# EAGLE schematic Wombat Lab Schematic (EAGLE 9.1.3)
COMPANY: ADAFRUIT INDUSTRIES; DRAWN: FZHAO; REV: A

## Sheet 1 of 17
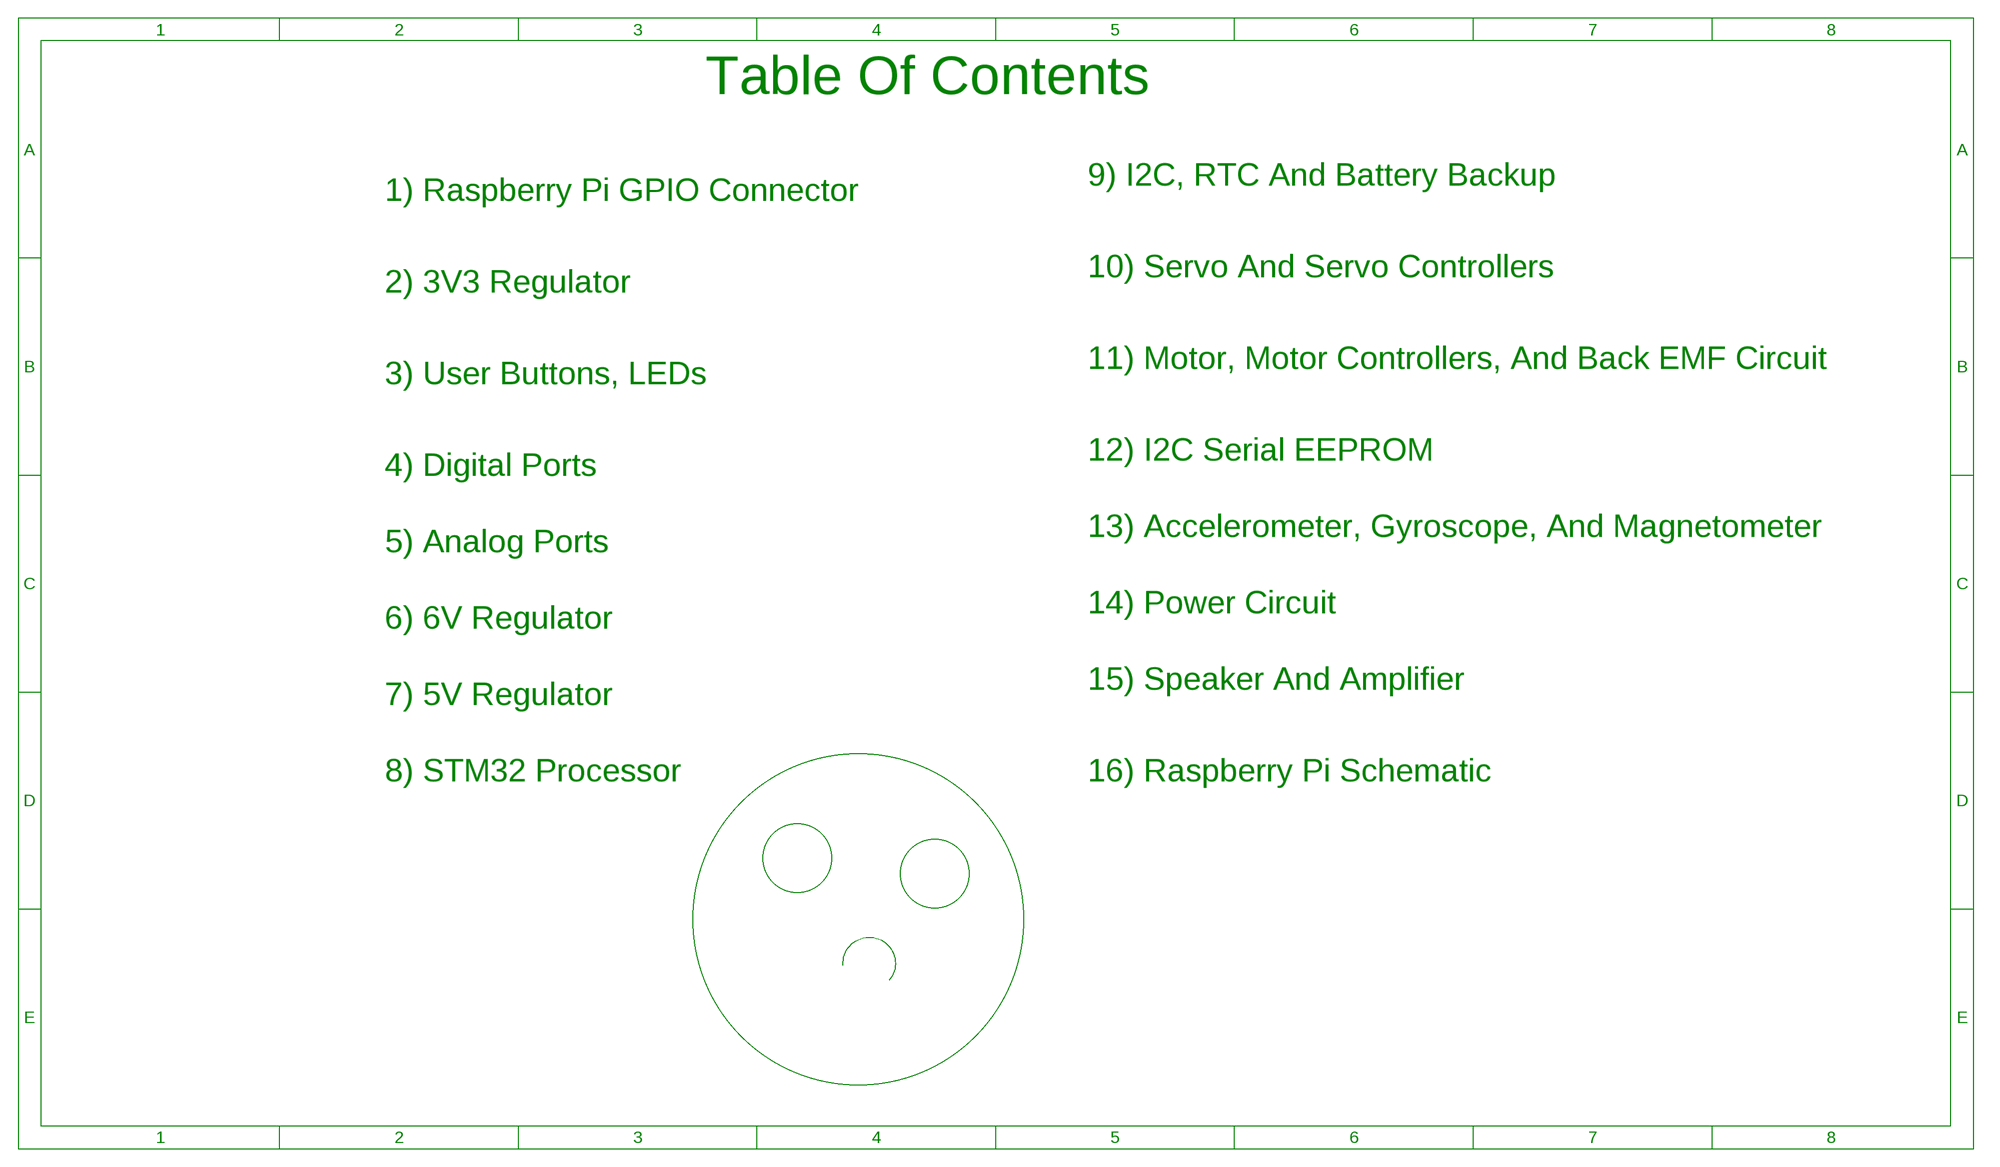
[diagram p0: schematic, sheet 1]

### Notes on the sheet
- Table Of Contents
- 9) I2C, RTC And Battery Backup
- 1) Raspberry Pi GPIO Connector
- 10) Servo And Servo Controllers
- 2) 3V3 Regulator
- 11) Motor, Motor Controllers, And Back EMF Circuit
- 3) User Buttons, LEDs
- 12) I2C Serial EEPROM
- 4) Digital Ports
- 13) Accelerometer, Gyroscope, And Magnetometer
- 5) Analog Ports
- 14) Power Circuit
- 6) 6V Regulator
- 15) Speaker And Amplifier
- 7) 5V Regulator
- 8) STM32 Processor | 16) Raspberry Pi Schematic

## Sheet 2 of 17
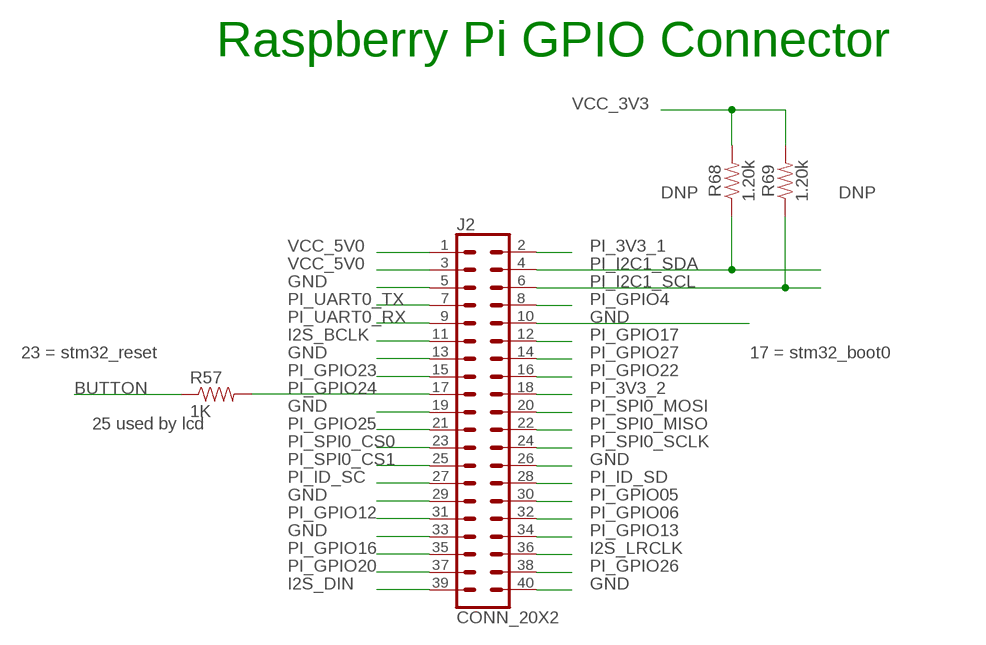
[diagram p1: schematic, sheet 2]

### Parts
J2  CONN_20X2  [2X20]
R57  1K  RESISTOR0603-RES  [0603-RES]
R68  1.20k  1.20KOHM-0603-1/10W-1%  [0603]
R69  1.20k  1.20KOHM-0603-1/10W-1%  [0603]

### Nets
BUTTON: R57.1 ; also sheet 4,9
GND: J2.5 J2.10 J2.13 J2.19 J2.26 J2.29 J2.33 J2.40 ; also sheet 3,4,5,6,7,8,9,10,11,12,13,14,15,16,17
I2S_BCLK: J2.11 ; also sheet 16
I2S_DIN: J2.39 ; also sheet 16
I2S_LRCLK: J2.36 ; also sheet 16
PI_3V3_1: J2.2
PI_3V3_2: J2.18
PI_GPIO4: J2.8
PI_GPIO05: J2.30
PI_GPIO06: J2.32
PI_GPIO12: J2.31
PI_GPIO13: J2.34
PI_GPIO16: J2.35
PI_GPIO17: J2.12 ; also sheet 9
PI_GPIO20: J2.37
PI_GPIO22: J2.16
PI_GPIO23: J2.15 ; also sheet 9
PI_GPIO24: J2.17 R57.2
PI_GPIO25: J2.21 ; also sheet 17
PI_GPIO26: J2.38
PI_GPIO27: J2.14
PI_I2C1_SCL: J2.6 R69.1 ; also sheet 10,13,17
PI_I2C1_SDA: J2.4 R68.1 ; also sheet 10,13,17
PI_ID_SC: J2.27
PI_ID_SD: J2.28
PI_SPI0_CS0: J2.23 ; also sheet 9
PI_SPI0_CS1: J2.25
PI_SPI0_MISO: J2.22 ; also sheet 9
PI_SPI0_MOSI: J2.20 ; also sheet 9
PI_SPI0_SCLK: J2.24 ; also sheet 9
PI_UART0_RX: J2.9 ; also sheet 9
PI_UART0_TX: J2.7 ; also sheet 9
VCC_3V3: R68.2 R69.2 ; also sheet 3,4,5,6,9,10,11,12,13,14,15,17
VCC_5V0: J2.1 J2.3 ; also sheet 3,8,11,16,17

### Notes on the sheet
- Raspberry Pi GPIO Connector
- DNP | DNP
- 23 = stm32_reset | 17 = stm32_boot0
- 25 used by lcd

## Sheet 3 of 17
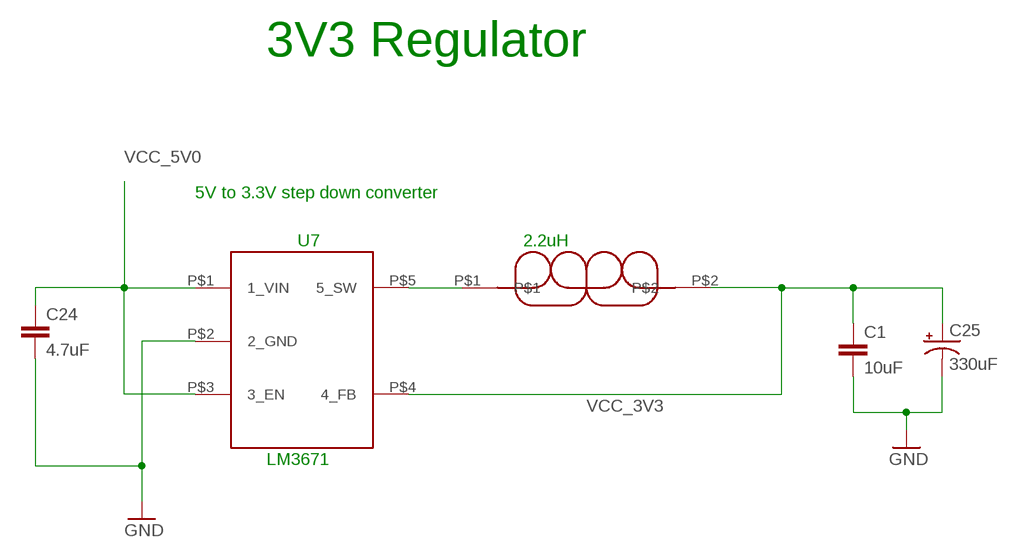
[diagram p2: schematic, sheet 3]

### Parts
C1  10uF  CAP0603-CAP  [0603-CAP]
C24  4.7uF  CAP0603-CAP  [0603-CAP]
C25  330uF  CAP_POLD  [PANASONIC_D]
U7  LM3671  [SOT-23-5]
U8  2.2uH  CDRH2D14NP  [3P2MM-X-3P2MM-INDUCTOR]

### Nets
GND: C1.2 C24.2 C25.- U7.P$2(2_GND) ; also sheet 2,4,5,6,7,8,9,10,11,12,13,14,15,16,17
N$10: U7.P$5(5_SW) U8.P$1
VCC_3V3: C1.1 C25.+ U7.P$4(4_FB) U8.P$2 ; also sheet 2,4,5,6,9,10,11,12,13,14,15,17
VCC_5V0: C24.1 U7.P$1(1_VIN) U7.P$3(3_EN) ; also sheet 2,8,11,16,17

### Notes on the sheet
- 3V3 Regulator
- 5V to 3.3V step down converter
- U7 | 2.2uH
- LM3671

## Sheet 4 of 17
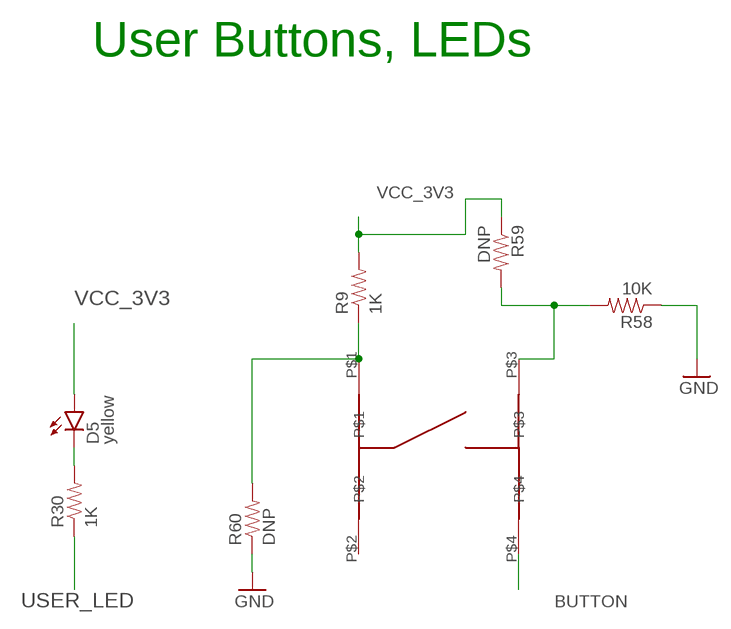
[diagram p3: schematic, sheet 4]

### Parts
D5  yellow  LED0603  [LED-0603]
R9  1K  RESISTOR0603-RES  [0603-RES]
R30  1K  RESISTOR0603-RES  [0603-RES]
R58  10K  RESISTOR0603-RES  [0603-RES]
R59  DNP  RESISTOR0603-RES  [0603-RES]
R60  DNP  RESISTOR0603-RES  [0603-RES]
U75  PUSHBUTTON-1571527-2  [BUTTON-1571527-2]

### Nets
BUTTON: U75.P$4 ; also sheet 2,9
GND: R58.1 R60.1 ; also sheet 2,3,5,6,7,8,9,10,11,12,13,14,15,16,17
N$19: D5.C R30.2
N$64: R9.1 R60.2 U75.P$1
N$65: R58.2 R59.2 U75.P$3
USER_LED: R30.1 ; also sheet 9
VCC_3V3: D5.A R9.2 R59.1 ; also sheet 2,3,5,6,9,10,11,12,13,14,15,17
Unconnected: U75.P$2

### Notes on the sheet
- User Buttons, LEDs

## Sheet 5 of 17
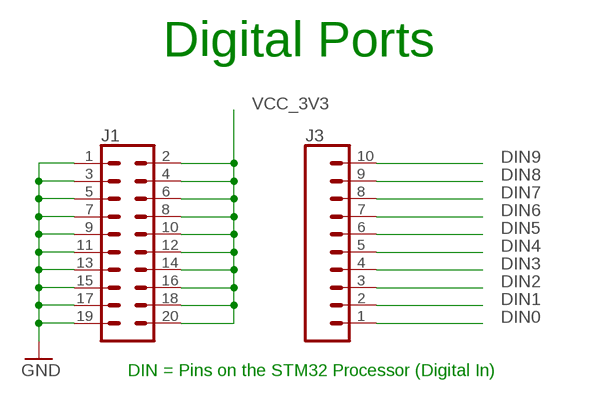
[diagram p4: schematic, sheet 5]

### Parts
J1  CONN_10X2  [2X10]
J3  CONN_10"  [1X10]

### Nets
DIN0: J3.1 ; also sheet 9
DIN1: J3.2 ; also sheet 9
DIN2: J3.3 ; also sheet 9
DIN3: J3.4 ; also sheet 9
DIN4: J3.5 ; also sheet 9
DIN5: J3.6 ; also sheet 9
DIN6: J3.7 ; also sheet 9
DIN7: J3.8 ; also sheet 9
DIN8: J3.9 ; also sheet 9
DIN9: J3.10 ; also sheet 9
GND: J1.1 J1.3 J1.5 J1.7 J1.9 J1.11 J1.13 J1.15 J1.17 J1.19 ; also sheet 2,3,4,6,7,8,9,10,11,12,13,14,15,16,17
VCC_3V3: J1.2 J1.4 J1.6 J1.8 J1.10 J1.12 J1.14 J1.16 J1.18 J1.20 ; also sheet 2,3,4,6,9,10,11,12,13,14,15,17

### Notes on the sheet
- Digital Ports
- DIN = Pins on the STM32 Processor (Digital In)

## Sheet 6 of 17
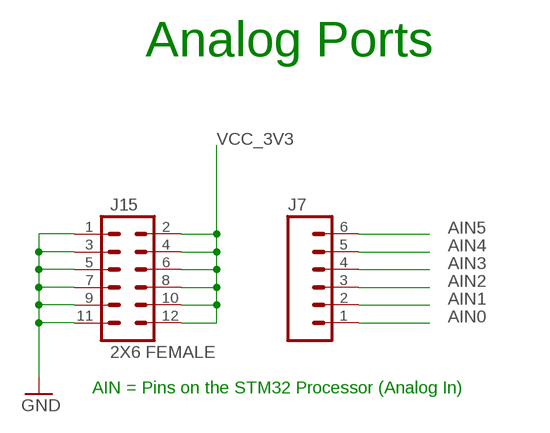
[diagram p5: schematic, sheet 6]

### Parts
J7  M06SILK_FEMALE_PTH  [1X06]
J15  2X6 FEMALE  M06X2PTH_FEMALE  [2X6]

### Nets
AIN0: J7.1 ; also sheet 9
AIN1: J7.2 ; also sheet 9
AIN2: J7.3 ; also sheet 9
AIN3: J7.4 ; also sheet 9
AIN4: J7.5 ; also sheet 9
AIN5: J7.6 ; also sheet 9
GND: J15.1 J15.3 J15.5 J15.7 J15.9 J15.11 ; also sheet 2,3,4,5,7,8,9,10,11,12,13,14,15,16,17
VCC_3V3: J15.2 J15.4 J15.6 J15.8 J15.10 J15.12 ; also sheet 2,3,4,5,9,10,11,12,13,14,15,17

### Notes on the sheet
- Analog Ports
- AIN = Pins on the STM32 Processor (Analog In)

## Sheet 7 of 17
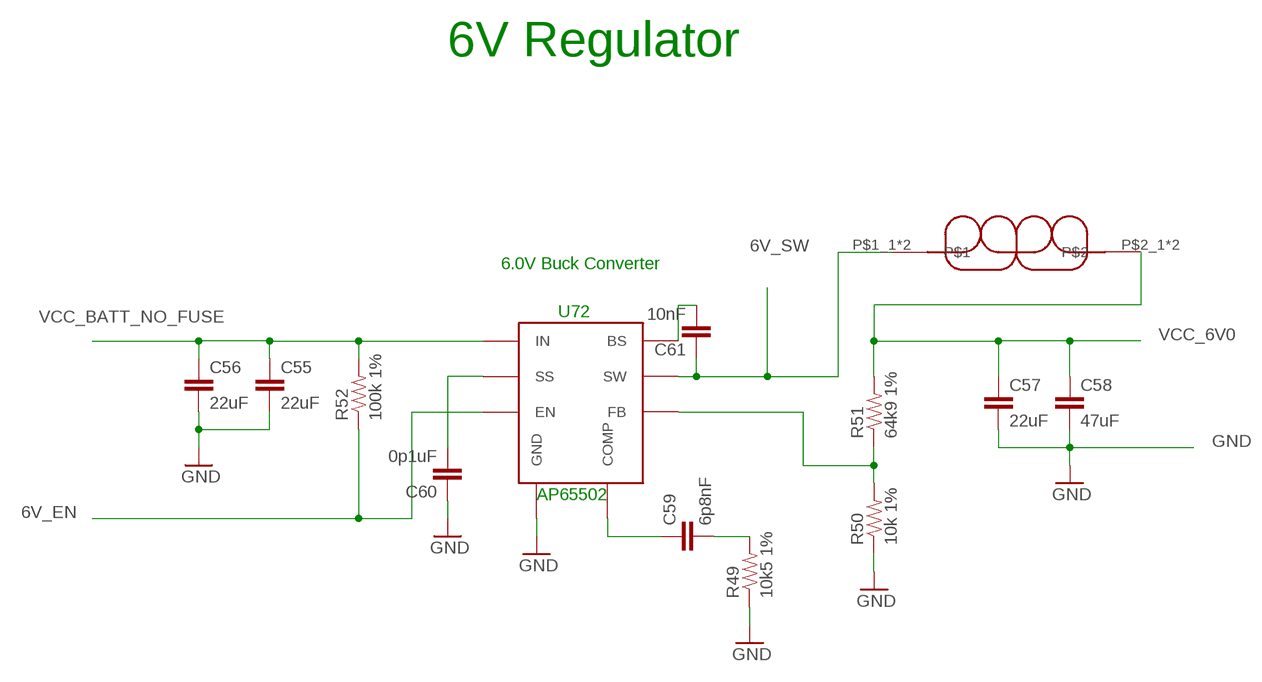
[diagram p6: schematic, sheet 7]

### Parts
C55  22uF  CAP1210  [1210@1]
C56  22uF  CAP1210  [1210@1]
C57  22uF  CAP1210  [1210@1]
C58  47uF  CAP1210  [1210@1]
C59  6p8nF  CAP0603-CAP  [0603-CAP]
C60  0p1uF  CAP0603-CAP  [0603-CAP]
C61  10nF  CAP0603-CAP  [0603-CAP]
L2  6.5uH  INDUCTOR-COMBO-3232-1050  [INDUCT-3232-1050]
R49  10k5 1%  RESISTOR0603  [0603-RES]
R50  10k 1%  RESISTOR0603  [0603-RES]
R51  64k9 1%  RESISTOR0603  [0603-RES]
R52  100k 1%  RESISTOR0603  [0603-RES]
U72  AP65502  AP65502SP-13  [SO-8EP]

### Nets
6V_EN: R52.1 U72.7(EN) ; also sheet 9
6V_SW: C61.1 L2.P$1_1 L2.P$1_2 U72.3(SW)
GND: C55.2 C56.2 C57.2 C58.2 C60.1 R49.1 R50.1 U72.4(GND) U72.GND U72.V$1(GND) U72.V$2(GND) U72.V$3(GND) U72.V$4(GND) U72.V$5(GND) U72.V$6(GND) U72.V$7(GND) U72.V$8(GND) U72.V$9(GND) U72.V$10(GND) U72.V$11(GND) U72.V$12(GND) U72.V$13(GND) U72.V$14(GND) U72.V$15(GND) ; also sheet 2,3,4,5,6,8,9,10,11,12,13,14,15,16,17
N$32: C61.2 U72.1(BS)
N$33: C59.1 U72.6(COMP)
N$34: C59.2 R49.2
N$35: C60.2 U72.8(SS)
N$36: R50.2 R51.1 U72.5(FB)
VCC_6V0: C57.1 C58.1 L2.P$2_1 L2.P$2_2 R51.2 ; also sheet 11
VCC_BATT_NO_FUSE: C55.1 C56.1 R52.2 U72.2(IN) ; also sheet 8,15

### Notes on the sheet
- 6V Regulator
- 6.0V Buck Converter
- U72
- AP65502

## Sheet 8 of 17
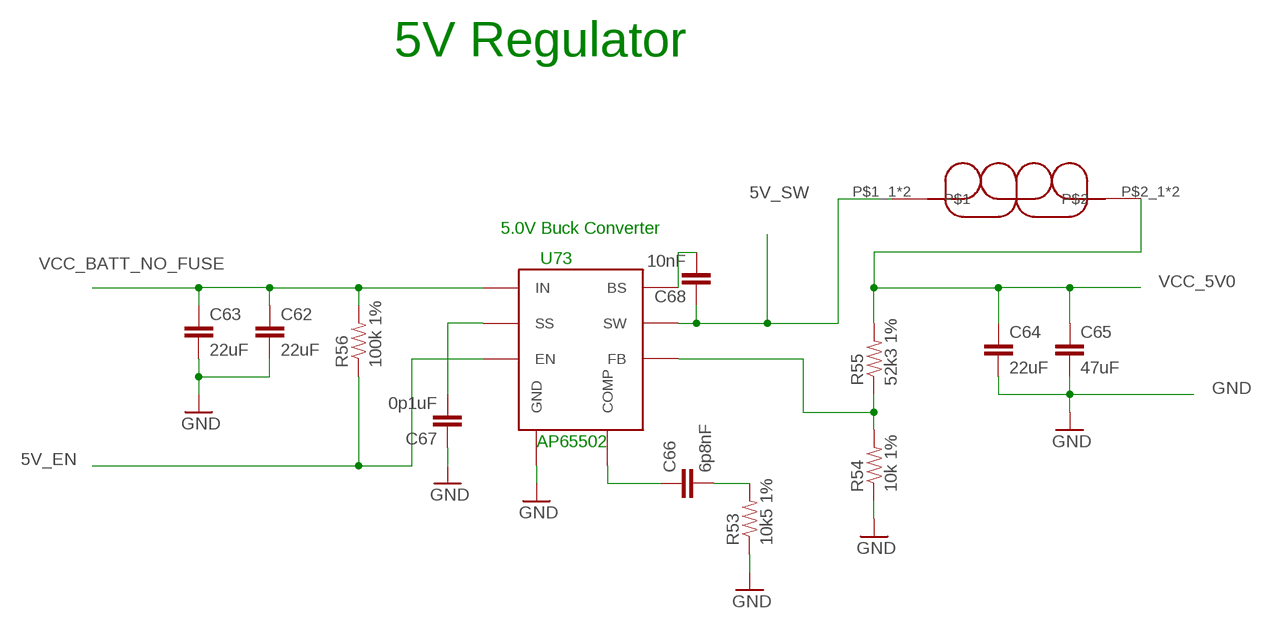
[diagram p7: schematic, sheet 8]

### Parts
C62  22uF  CAP1210  [1210@1]
C63  22uF  CAP1210  [1210@1]
C64  22uF  CAP1210  [1210@1]
C65  47uF  CAP1210  [1210@1]
C66  6p8nF  CAP0603-CAP  [0603-CAP]
C67  0p1uF  CAP0603-CAP  [0603-CAP]
C68  10nF  CAP0603-CAP  [0603-CAP]
L4  6.5uH  INDUCTOR-COMBO-3232-1050  [INDUCT-3232-1050]
R53  10k5 1%  RESISTOR0603  [0603-RES]
R54  10k 1%  RESISTOR0603  [0603-RES]
R55  52k3 1%  RESISTOR0603  [0603-RES]
R56  100k 1%  RESISTOR0603  [0603-RES]
U73  AP65502  AP65502SP-13  [SO-8EP]

### Nets
5V_EN: R56.1 U73.7(EN)
5V_SW: C68.1 L4.P$1_1 L4.P$1_2 U73.3(SW)
GND: C62.2 C63.2 C64.2 C65.2 C67.1 R53.1 R54.1 U73.4(GND) U73.GND U73.V$1(GND) U73.V$2(GND) U73.V$3(GND) U73.V$4(GND) U73.V$5(GND) U73.V$6(GND) U73.V$7(GND) U73.V$8(GND) U73.V$9(GND) U73.V$10(GND) U73.V$11(GND) U73.V$12(GND) U73.V$13(GND) U73.V$14(GND) U73.V$15(GND) ; also sheet 2,3,4,5,6,7,9,10,11,12,13,14,15,16,17
N$37: C68.2 U73.1(BS)
N$38: C66.1 U73.6(COMP)
N$39: C66.2 R53.2
N$41: C67.2 U73.8(SS)
N$42: R54.2 R55.1 U73.5(FB)
VCC_5V0: C64.1 C65.1 L4.P$2_1 L4.P$2_2 R55.2 ; also sheet 2,3,11,16,17
VCC_BATT_NO_FUSE: C62.1 C63.1 R56.2 U73.2(IN) ; also sheet 7,15

### Notes on the sheet
- 5V Regulator
- 5.0V Buck Converter
- U73
- AP65502

## Sheet 9 of 17
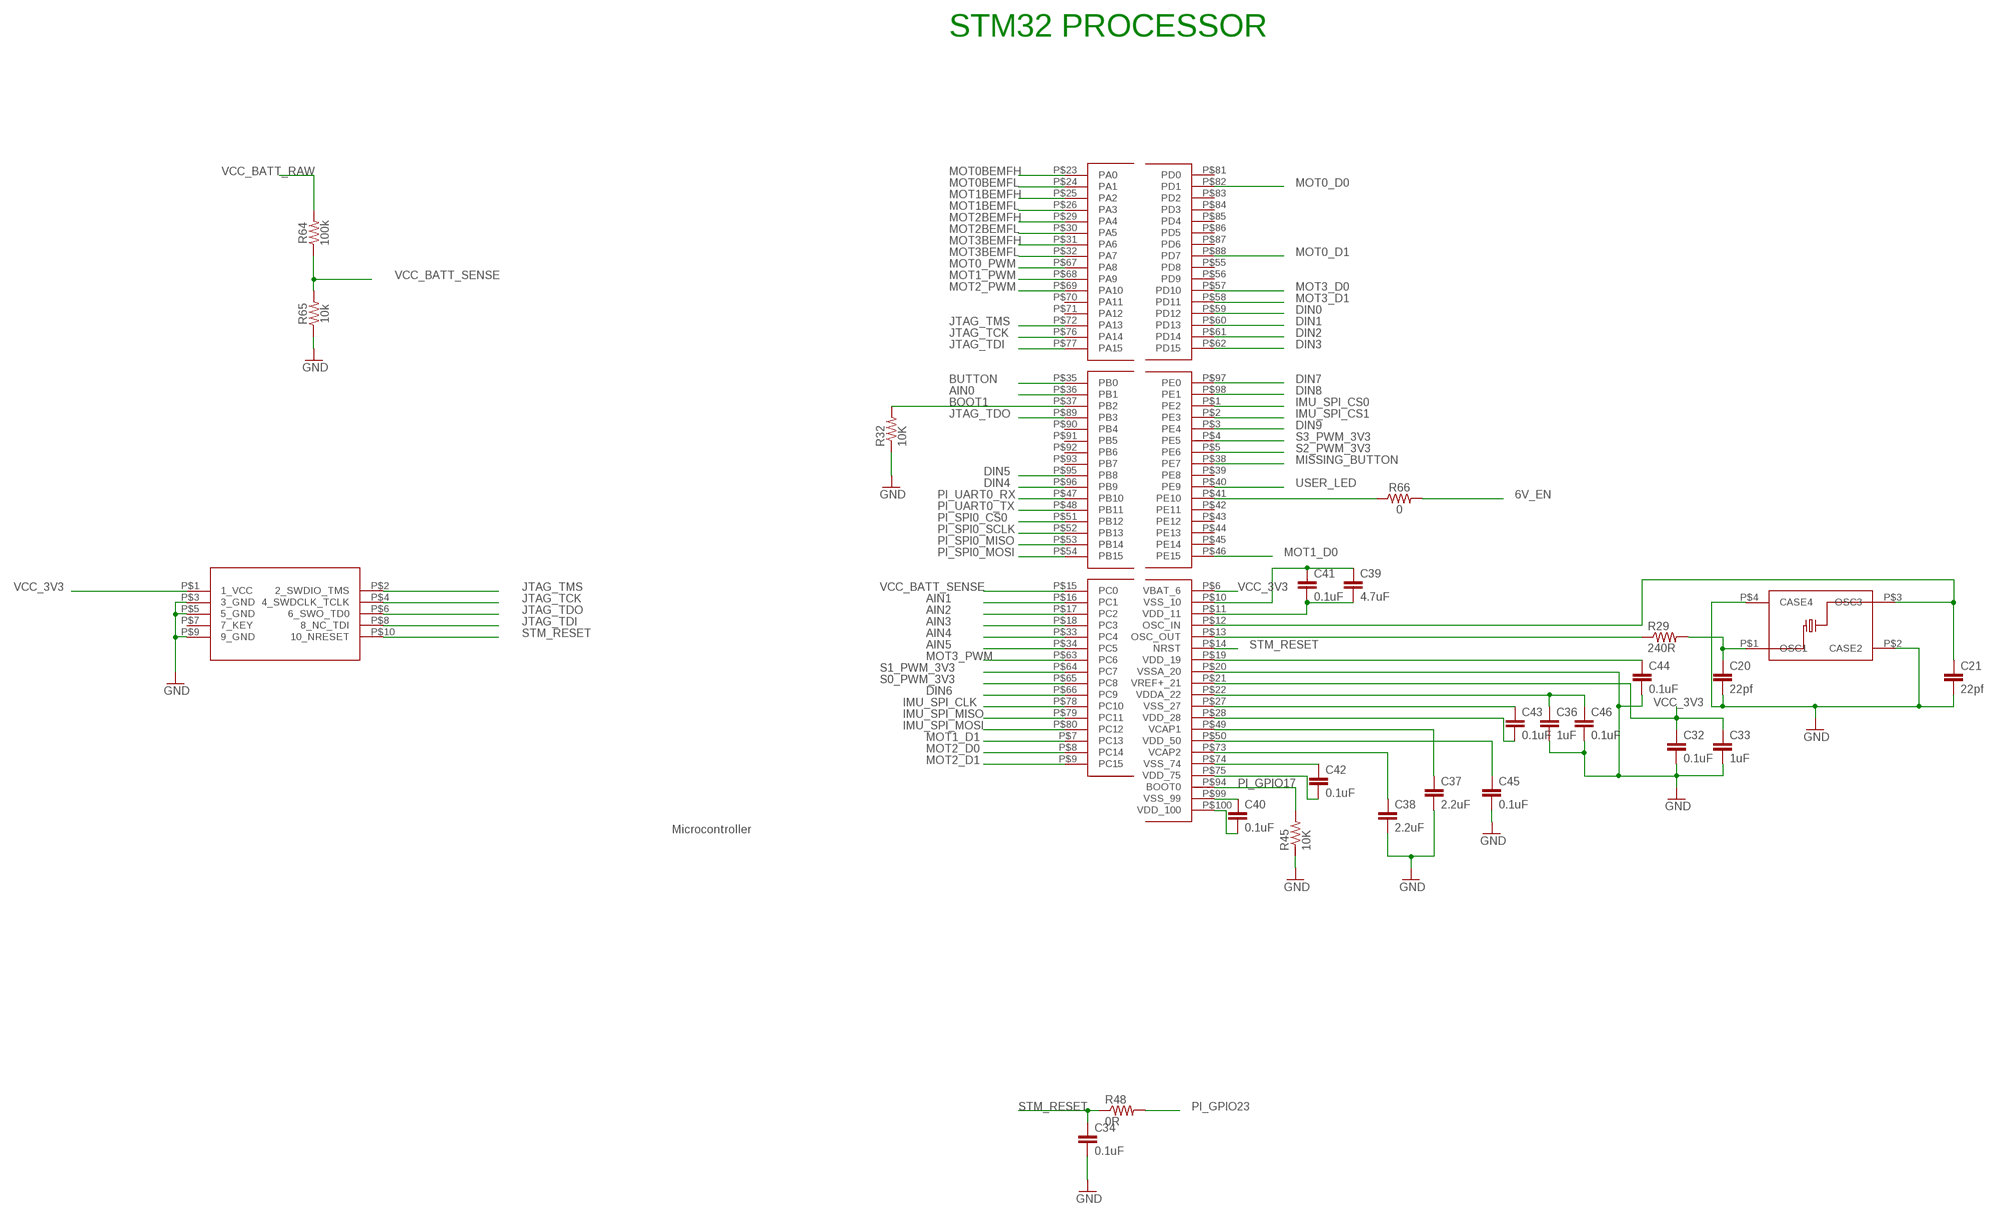
[diagram p8: schematic, sheet 9]

### Parts
C20  22pf  CAP0603-CAP  [0603-CAP]
C21  22pf  CAP0603-CAP  [0603-CAP]
C32  0.1uF  CAP0603-CAP  [0603-CAP]
C33  1uF  CAP0603-CAP  [0603-CAP]
C34  0.1uF  CAP0603-CAP  [0603-CAP]
C36  1uF  CAP0603-CAP  [0603-CAP]
C37  2.2uF  CAP0603-CAP  [0603-CAP]
C38  2.2uF  CAP0603-CAP  [0603-CAP]
C39  4.7uF  CAP0603-CAP  [0603-CAP]
C40  0.1uF  CAP0603-CAP  [0603-CAP]
C41  0.1uF  CAP0603-CAP  [0603-CAP]
C42  0.1uF  CAP0603-CAP  [0603-CAP]
C43  0.1uF  CAP0603-CAP  [0603-CAP]
C44  0.1uF  CAP0603-CAP  [0603-CAP]
C45  0.1uF  CAP0603-CAP  [0603-CAP]
C46  0.1uF  CAP0603-CAP  [0603-CAP]
R29  240R  RESISTOR0603  [0603-RES]
R32  10K  RESISTOR0603  [0603-RES]
R45  10K  RESISTOR0603  [0603-RES]
R48  0R  RESISTOR0603  [0603-RES]
R64  100k  100KOHM-0603-1/10W-1%  [0603]
R65  10k  10KOHM-0603-1/10W-1%  [0603]
R66  0  0OHM-0603-1/10W-5%  [0603]
U37  STM32F427VIT6  [LQFP-100]
U38  TSX-3325  [TSX-3225]
U39  CORTEX_JTAG  [CORTEX-JTAG-HDR]

### Nets
6V_EN: R66.2 ; also sheet 7
AIN0: U37.P$36(PB1) ; also sheet 6
AIN1: U37.P$16(PC1) ; also sheet 6
AIN2: U37.P$17(PC2) ; also sheet 6
AIN3: U37.P$18(PC3) ; also sheet 6
AIN4: U37.P$33(PC4) ; also sheet 6
AIN5: U37.P$34(PC5) ; also sheet 6
BOOT1: R32.2 U37.P$37(PB2)
BUTTON: U37.P$35(PB0) ; also sheet 2,4
DIN0: U37.P$59(PD12) ; also sheet 5
DIN1: U37.P$60(PD13) ; also sheet 5
DIN2: U37.P$61(PD14) ; also sheet 5
DIN3: U37.P$62(PD15) ; also sheet 5
DIN4: U37.P$96(PB9) ; also sheet 5
DIN5: U37.P$95(PB8) ; also sheet 5
DIN6: U37.P$66(PC9) ; also sheet 5
DIN7: U37.P$97(PE0) ; also sheet 5
DIN8: U37.P$98(PE1) ; also sheet 5
DIN9: U37.P$3(PE4) ; also sheet 5
GND: C20.2 C21.2 C32.2 C33.2 C34.2 C36.2 C37.2 C38.2 C39.1 C40.1 C41.1 C42.1 C43.1 C44.2 C45.2 C46.2 R32.1 R45.1 R65.1 U37.P$10(VSS_10) U37.P$20(VSSA_20) U37.P$27(VSS_27) U37.P$74(VSS_74) U37.P$99(VSS_99) U38.P$2(CASE2) U38.P$4(CASE4) U39.P$3(3_GND) U39.P$5(5_GND) U39.P$9(9_GND) ; also sheet 2,3,4,5,6,7,8,10,11,12,13,14,15,16,17
IMU_SPI_CLK: U37.P$78(PC10) ; also sheet 14
IMU_SPI_CS0: U37.P$1(PE2) ; also sheet 14
IMU_SPI_CS1: U37.P$2(PE3)
IMU_SPI_MISO: U37.P$79(PC11) ; also sheet 14
IMU_SPI_MOSI: U37.P$80(PC12) ; also sheet 14
JTAG_TCK: U37.P$76(PA14) U39.P$4(4_SWDCLK_TCLK)
JTAG_TDI: U37.P$77(PA15) U39.P$8(8_NC_TDI)
JTAG_TDO: U37.P$89(PB3) U39.P$6(6_SWO_TD0)
JTAG_TMS: U37.P$72(PA13) U39.P$2(2_SWDIO_TMS)
MISSING_BUTTON: U37.P$38(PE7)
MOT0_D0: U37.P$82(PD1) ; also sheet 12
MOT0_D1: U37.P$88(PD7) ; also sheet 12
MOT0_PWM: U37.P$67(PA8) ; also sheet 12
MOT0BEMFH: U37.P$23(PA0) ; also sheet 12
MOT0BEMFL: U37.P$24(PA1) ; also sheet 12
MOT1_D0: U37.P$46(PE15) ; also sheet 12
MOT1_D1: U37.P$7(PC13) ; also sheet 12
MOT1_PWM: U37.P$68(PA9) ; also sheet 12
MOT1BEMFH: U37.P$25(PA2) ; also sheet 12
MOT1BEMFL: U37.P$26(PA3) ; also sheet 12
MOT2_D0: U37.P$8(PC14) ; also sheet 12
MOT2_D1: U37.P$9(PC15) ; also sheet 12
MOT2_PWM: U37.P$69(PA10) ; also sheet 12
MOT2BEMFH: U37.P$29(PA4) ; also sheet 12
MOT2BEMFL: U37.P$30(PA5) ; also sheet 12
MOT3_D0: U37.P$57(PD10) ; also sheet 12
MOT3_D1: U37.P$58(PD11) ; also sheet 12
MOT3_PWM: U37.P$63(PC6) ; also sheet 12
MOT3BEMFH: U37.P$31(PA6) ; also sheet 12
MOT3BEMFL: U37.P$32(PA7) ; also sheet 12
N$40: C20.1 R29.2 U38.P$1(OSC1)
N$69: R66.1 U37.P$41(PE10)
OSC_IN: C21.1 U37.P$12(OSC_IN) U38.P$3(OSC3)
OSC_OUT: R29.1 U37.P$13(OSC_OUT)
PI_GPIO17: R45.2 U37.P$94(BOOT0) ; also sheet 2
PI_GPIO23: R48.2 ; also sheet 2
PI_SPI0_CS0: U37.P$51(PB12) ; also sheet 2
PI_SPI0_MISO: U37.P$53(PB14) ; also sheet 2
PI_SPI0_MOSI: U37.P$54(PB15) ; also sheet 2
PI_SPI0_SCLK: U37.P$52(PB13) ; also sheet 2
PI_UART0_RX: U37.P$47(PB10) ; also sheet 2
PI_UART0_TX: U37.P$48(PB11) ; also sheet 2
S0_PWM_3V3: U37.P$65(PC8) ; also sheet 11
S1_PWM_3V3: U37.P$64(PC7) ; also sheet 11
S2_PWM_3V3: U37.P$5(PE6) ; also sheet 11
S3_PWM_3V3: U37.P$4(PE5) ; also sheet 11
STM_RESET: C34.1 R48.1 U37.P$14(NRST) U39.P$10(10_NRESET)
USER_LED: U37.P$40(PE9) ; also sheet 4
VCAP1: C37.1 U37.P$49(VCAP1)
VCAP2: C38.1 U37.P$73(VCAP2)
VCC_3V3: C32.1 C33.1 C36.1 C39.2 C40.2 C41.2 C42.2 C43.2 C44.1 C45.1 C46.1 U37.P$6(VBAT_6) U37.P$11(VDD_11) U37.P$19(VDD_19) U37.P$21(VREF+_21) U37.P$22(VDDA_22) U37.P$28(VDD_28) U37.P$50(VDD_50) U37.P$75(VDD_75) U37.P$100(VDD_100) U39.P$1(1_VCC) ; also sheet 2,3,4,5,6,10,11,12,13,14,15,17
VCC_BATT_RAW: R64.2 ; also sheet 15
VCC_BATT_SENSE: R64.1 R65.2 U37.P$15(PC0)
Unconnected: U37.P$39(PE8) U37.P$42(PE11) U37.P$43(PE12) U37.P$44(PE13) U37.P$45(PE14) U37.P$55(PD8) U37.P$56(PD9) U37.P$70(PA11) U37.P$71(PA12) U37.P$81(PD0) U37.P$83(PD2) U37.P$84(PD3) U37.P$85(PD4) U37.P$86(PD5) U37.P$87(PD6) U37.P$90(PB4) U37.P$91(PB5) U37.P$92(PB6) U37.P$93(PB7) U39.P$7(7_KEY)

### Notes on the sheet
- STM32 PROCESSOR
- Microcontroller

## Sheet 10 of 17
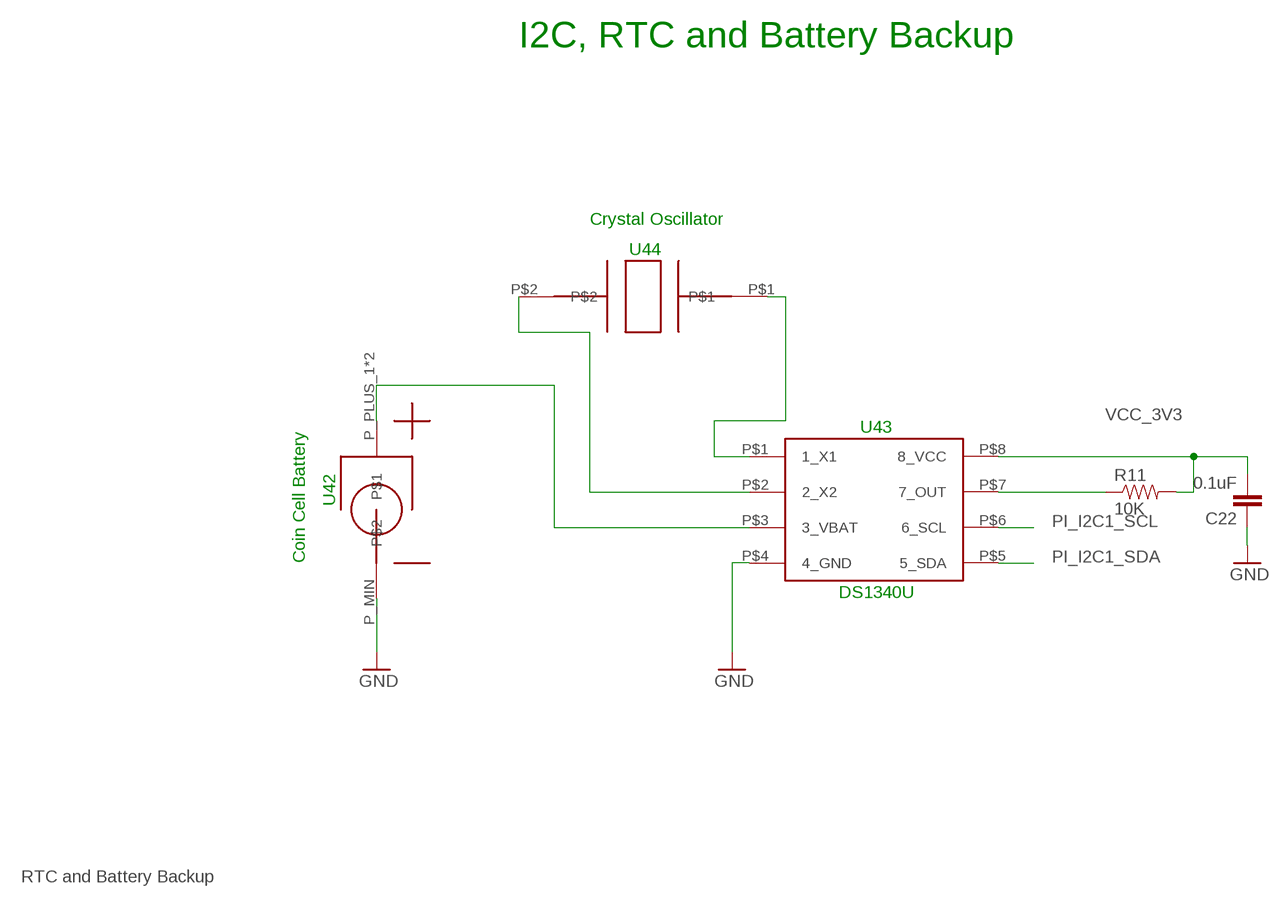
[diagram p9: schematic, sheet 10]

### Parts
C22  0.1uF  CAP0603-CAP  [0603-CAP]
R11  10K  RESISTOR0603  [0603-RES]
U42  COINCELL_6P8MM  [COIN_CELL_HOLDER_6P8MM]
U43  DS1340U  [USOP-8]
U44  CRYSTAL-ECS-ECX34B  [CRYSTAL-ECX34B-3P2MM_1P5MM]

### Nets
GND: C22.1 U42.P_MIN U43.P$4(4_GND) ; also sheet 2,3,4,5,6,7,8,9,11,12,13,14,15,16,17
N$15: U42.P_PLUS_1 U42.P_PLUS_2 U43.P$3(3_VBAT)
N$16: U43.P$2(2_X2) U44.P$2
N$17: U43.P$1(1_X1) U44.P$1
N$21: R11.1 U43.P$7(7_OUT)
PI_I2C1_SCL: U43.P$6(6_SCL) ; also sheet 2,13,17
PI_I2C1_SDA: U43.P$5(5_SDA) ; also sheet 2,13,17
VCC_3V3: C22.2 R11.2 U43.P$8(8_VCC) ; also sheet 2,3,4,5,6,9,11,12,13,14,15,17

### Notes on the sheet
- I2C, RTC and Battery Backup
- Crystal Oscillator
- U44
- U43
- U42
- Coin Cell Battery
- DS1340U
- RTC and Battery Backup

## Sheet 11 of 17
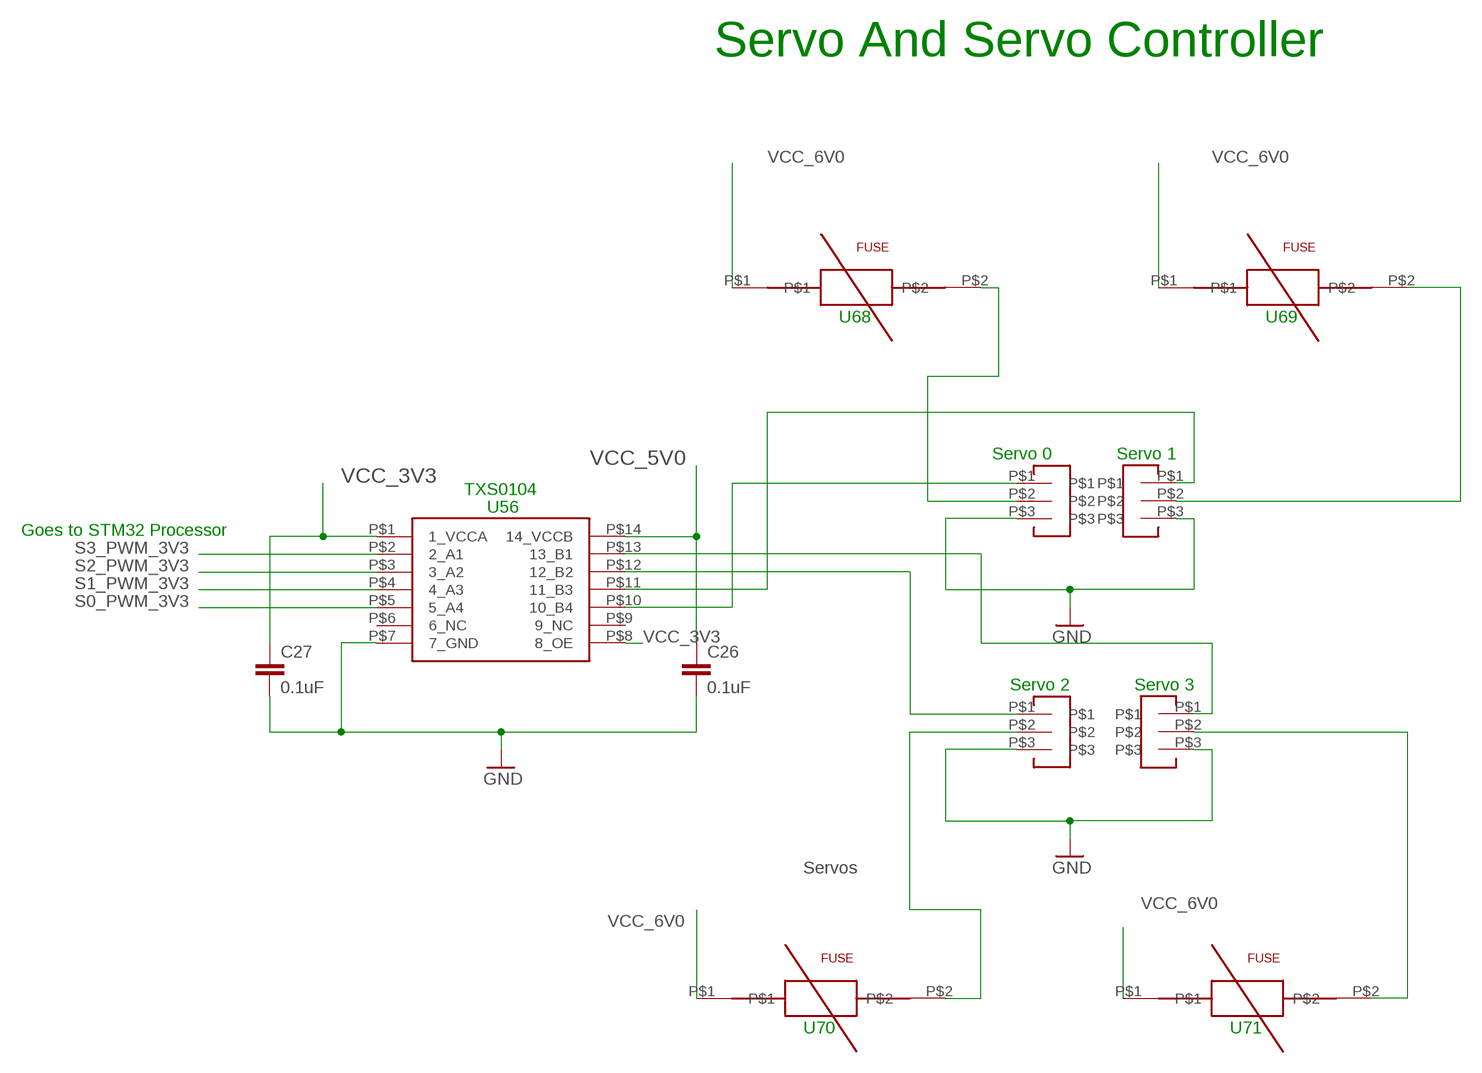
[diagram p10: schematic, sheet 11]

### Parts
C26  0.1uF  CAP0603-CAP  [0603-CAP]
C27  0.1uF  CAP0603-CAP  [0603-CAP]
U30  CONN-HEADER-5-103414-1  [HEADER-5-103414-1]
U41  CONN-HEADER-5-103414-1  [HEADER-5-103414-1]
U56  TXS0104  [TSSOP14]
U68  FUSE-RESET-0603L100SLYR  [0603]
U69  FUSE-RESET-0603L100SLYR  [0603]
U70  FUSE-RESET-0603L100SLYR  [0603]
U71  FUSE-RESET-0603L100SLYR  [0603]
U76  CONN-HEADER-5-103414-1  [HEADER-5-103414-1]
U77  CONN-HEADER-5-103414-1  [HEADER-5-103414-1]

### Nets
GND: C26.2 C27.2 U30.P$3 U41.P$3 U56.P$7(7_GND) U76.P$3 U77.P$3 ; also sheet 2,3,4,5,6,7,8,9,10,12,13,14,15,16,17
N$28: U71.P$2 U77.P$2
N$29: U70.P$2 U76.P$2
N$30: U30.P$2 U68.P$2
N$31: U41.P$2 U69.P$2
S0_PWM_3V3: U56.P$5(5_A4) ; also sheet 9
S0_PWM_5V0: U30.P$1 U56.P$10(10_B4)
S1_PWM_3V3: U56.P$4(4_A3) ; also sheet 9
S1_PWM_5V0: U41.P$1 U56.P$11(11_B3)
S2_PWM_3V3: U56.P$3(3_A2) ; also sheet 9
S2_PWM_5V0: U56.P$12(12_B2) U76.P$1
S3_PWM_3V3: U56.P$2(2_A1) ; also sheet 9
S3_PWM_5V0: U56.P$13(13_B1) U77.P$1
VCC_3V3: C27.1 U56.P$1(1_VCCA) U56.P$8(8_OE) ; also sheet 2,3,4,5,6,9,10,12,13,14,15,17
VCC_5V0: C26.1 U56.P$14(14_VCCB) ; also sheet 2,3,8,16,17
VCC_6V0: U68.P$1 U69.P$1 U70.P$1 U71.P$1 ; also sheet 7
Unconnected: U56.P$6(6_NC) U56.P$9(9_NC)

### Notes on the sheet
- Servo And Servo Controller
- U68 | U69
- Servo 0 | Servo 1
- TXS0104
- U56
- Goes to STM32 Processor
- Servo 2 | Servo 3
- Servos
- U70 | U71

## Sheet 12 of 17
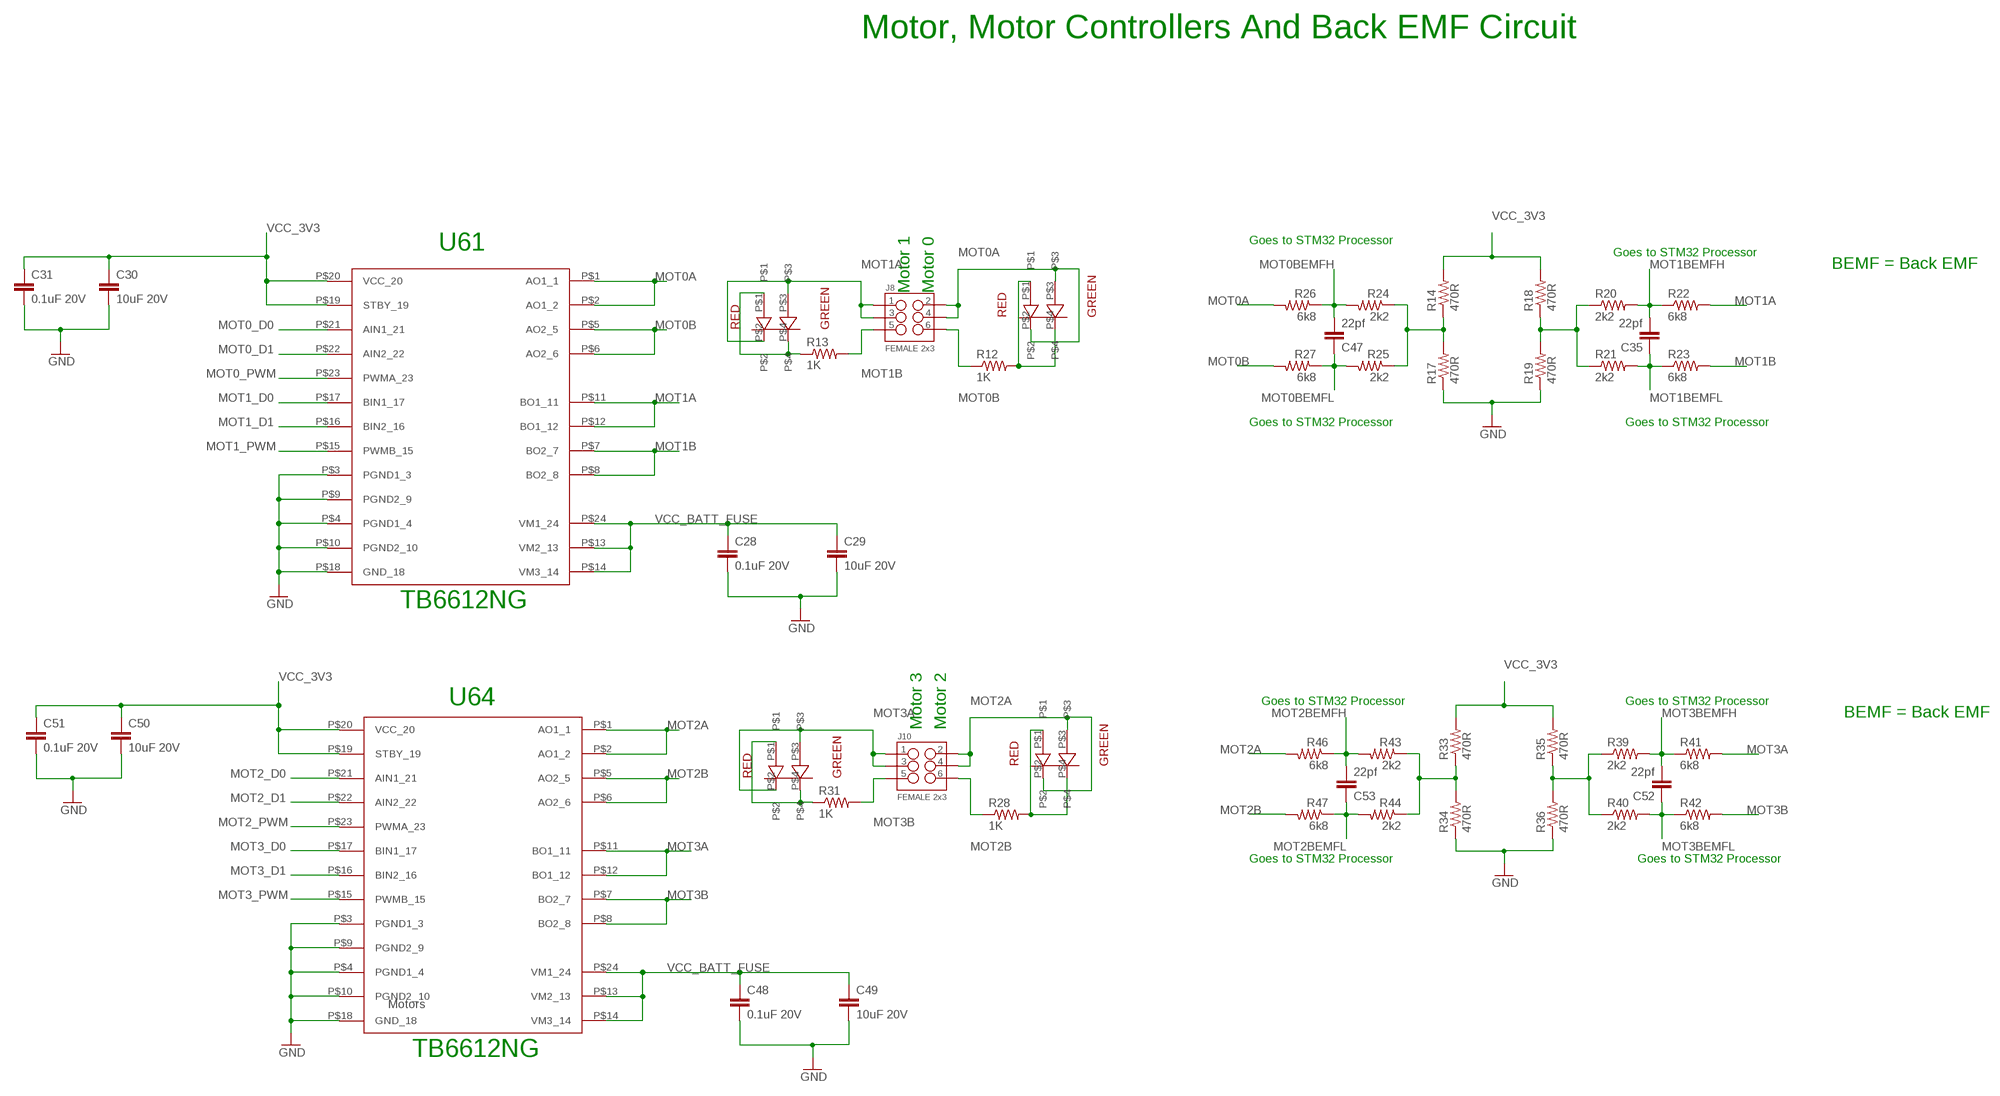
[diagram p11: schematic, sheet 12]

### Parts
C28  0.1uF 20V  CAP0603-CAP  [0603-CAP]
C29  10uF 20V  CAP0603-CAP  [0603-CAP]
C30  10uF 20V  CAP0603-CAP  [0603-CAP]
C31  0.1uF 20V  CAP0603-CAP  [0603-CAP]
C35  22pf  CAP0603-CAP  [0603-CAP]
C47  22pf  CAP0603-CAP  [0603-CAP]
C48  0.1uF 20V  CAP0603-CAP  [0603-CAP]
C49  10uF 20V  CAP0603-CAP  [0603-CAP]
C50  10uF 20V  CAP0603-CAP  [0603-CAP]
C51  0.1uF 20V  CAP0603-CAP  [0603-CAP]
C52  22pf  CAP0603-CAP  [0603-CAP]
C53  22pf  CAP0603-CAP  [0603-CAP]
J8  FEMALE 2x3  M03X2FEMALE  [2X3]
J10  FEMALE 2x3  M03X2FEMALE  [2X3]
R12  1K  RESISTOR0603-RES  [0603-RES]
R13  1K  RESISTOR0603-RES  [0603-RES]
R14  470R  RESISTOR0603  [0603-RES]
R17  470R  RESISTOR0603  [0603-RES]
R18  470R  RESISTOR0603  [0603-RES]
R19  470R  RESISTOR0603  [0603-RES]
R20  2k2  RESISTOR0603  [0603-RES]
R21  2k2  RESISTOR0603  [0603-RES]
R22  6k8  RESISTOR0603  [0603-RES]
R23  6k8  RESISTOR0603  [0603-RES]
R24  2k2  RESISTOR0603  [0603-RES]
R25  2k2  RESISTOR0603  [0603-RES]
R26  6k8  RESISTOR0603  [0603-RES]
R27  6k8  RESISTOR0603  [0603-RES]
R28  1K  RESISTOR0603-RES  [0603-RES]
R31  1K  RESISTOR0603-RES  [0603-RES]
R33  470R  RESISTOR0603  [0603-RES]
R34  470R  RESISTOR0603  [0603-RES]
R35  470R  RESISTOR0603  [0603-RES]
R36  470R  RESISTOR0603  [0603-RES]
R39  2k2  RESISTOR0603  [0603-RES]
R40  2k2  RESISTOR0603  [0603-RES]
R41  6k8  RESISTOR0603  [0603-RES]
R42  6k8  RESISTOR0603  [0603-RES]
R43  2k2  RESISTOR0603  [0603-RES]
R44  2k2  RESISTOR0603  [0603-RES]
R46  6k8  RESISTOR0603  [0603-RES]
R47  6k8  RESISTOR0603  [0603-RES]
U61  TB6612FNG  [SSOP24]
U62  APB3025ESGC-F01  [DUAL_SMT_LED]
U63  APB3025ESGC-F01  [DUAL_SMT_LED]
U64  TB6612FNG  [SSOP24]
U65  APB3025ESGC-F01  [DUAL_SMT_LED]
U66  APB3025ESGC-F01  [DUAL_SMT_LED]

### Nets
GND: C28.2 C29.2 C30.2 C31.2 C48.2 C49.2 C50.2 C51.2 R17.1 R19.1 R34.1 R36.1 U61.P$3(PGND1_3) U61.P$4(PGND1_4) U61.P$9(PGND2_9) U61.P$10(PGND2_10) U61.P$18(GND_18) U64.P$3(PGND1_3) U64.P$4(PGND1_4) U64.P$9(PGND2_9) U64.P$10(PGND2_10) U64.P$18(GND_18) ; also sheet 2,3,4,5,6,7,8,9,10,11,13,14,15,16,17
MOT0_D0: U61.P$21(AIN1_21) ; also sheet 9
MOT0_D1: U61.P$22(AIN2_22) ; also sheet 9
MOT0_PWM: U61.P$23(PWMA_23) ; also sheet 9
MOT0A: J8.2 J8.4 R26.2 U61.P$1(AO1_1) U61.P$2(AO1_2) U63.P$2 U63.P$3
MOT0B: J8.6 R12.1 R27.2 U61.P$5(AO2_5) U61.P$6(AO2_6)
MOT0BEMFH: C47.2 R24.2 R26.1 ; also sheet 9
MOT0BEMFL: C47.1 R25.2 R27.1 ; also sheet 9
MOT1_D0: U61.P$17(BIN1_17) ; also sheet 9
MOT1_D1: U61.P$16(BIN2_16) ; also sheet 9
MOT1_PWM: U61.P$15(PWMB_15) ; also sheet 9
MOT1A: J8.1 J8.3 R22.2 U61.P$11(BO1_11) U61.P$12(BO1_12) U62.P$2 U62.P$3
MOT1B: J8.5 R13.2 R23.2 U61.P$7(BO2_7) U61.P$8(BO2_8)
MOT1BEMFH: C35.2 R20.2 R22.1 ; also sheet 9
MOT1BEMFL: C35.1 R21.2 R23.1 ; also sheet 9
MOT2_D0: U64.P$21(AIN1_21) ; also sheet 9
MOT2_D1: U64.P$22(AIN2_22) ; also sheet 9
MOT2_PWM: U64.P$23(PWMA_23) ; also sheet 9
MOT2A: J10.2 J10.4 R46.2 U64.P$1(AO1_1) U64.P$2(AO1_2) U66.P$2 U66.P$3
MOT2B: J10.6 R28.1 R47.2 U64.P$5(AO2_5) U64.P$6(AO2_6)
MOT2BEMFH: C53.2 R43.2 R46.1 ; also sheet 9
MOT2BEMFL: C53.1 R44.2 R47.1 ; also sheet 9
MOT3_D0: U64.P$17(BIN1_17) ; also sheet 9
MOT3_D1: U64.P$16(BIN2_16) ; also sheet 9
MOT3_PWM: U64.P$15(PWMB_15) ; also sheet 9
MOT3A: J10.1 J10.3 R41.2 U64.P$11(BO1_11) U64.P$12(BO1_12) U65.P$2 U65.P$3
MOT3B: J10.5 R31.2 R42.2 U64.P$7(BO2_7) U64.P$8(BO2_8)
MOT3BEMFH: C52.2 R39.2 R41.1 ; also sheet 9
MOT3BEMFL: C52.1 R40.2 R42.1 ; also sheet 9
N22: R13.1 U62.P$1 U62.P$4
N43: R31.1 U65.P$1 U65.P$4
N44: R28.2 U66.P$1 U66.P$4
N$23: R12.2 U63.P$1 U63.P$4
N$24: R18.1 R19.2 R20.1 R21.1
N$27: R14.1 R17.2 R24.1 R25.1
N$45: R35.1 R36.2 R39.1 R40.1
N$46: R33.1 R34.2 R43.1 R44.1
VCC_3V3: C30.1 C31.1 C50.1 C51.1 R14.2 R18.2 R33.2 R35.2 U61.P$19(STBY_19) U61.P$20(VCC_20) U64.P$19(STBY_19) U64.P$20(VCC_20) ; also sheet 2,3,4,5,6,9,10,11,13,14,15,17
VCC_BATT_FUSE: C28.1 C29.1 C48.1 C49.1 U61.P$13(VM2_13) U61.P$14(VM3_14) U61.P$24(VM1_24) U64.P$13(VM2_13) U64.P$14(VM3_14) U64.P$24(VM1_24) ; also sheet 15

### Notes on the sheet
- Motor, Motor Controllers And Back EMF Circuit
- U61
- Goes to STM32 Processor
- Goes to STM32 Processor
- BEMF = Back EMF
- Motor 1 | Motor 0
- Goes to STM32 Processor | Goes to STM32 Processor
- TB6612NG
- U64 | Goes to STM32 Processor | Goes to STM32 Processor
- BEMF = Back EMF
- Motor 3 | Motor 2
- Goes to STM32 Processor | Goes to STM32 Processor
- Motors
- TB6612NG

## Sheet 13 of 17
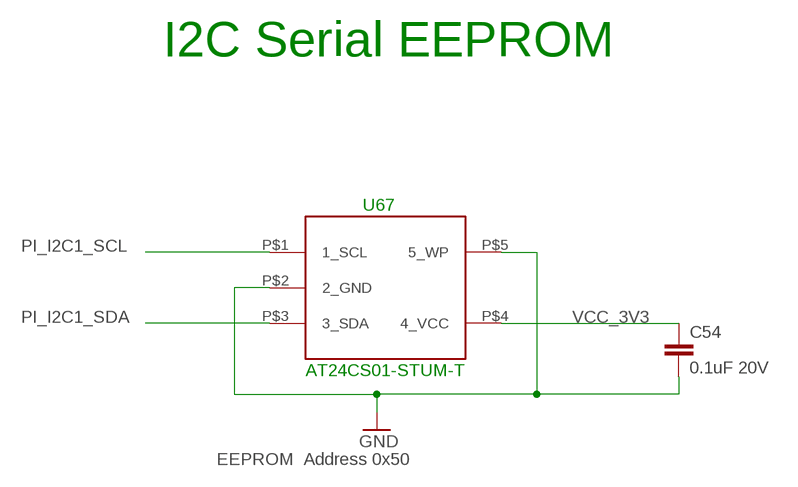
[diagram p12: schematic, sheet 13]

### Parts
C54  0.1uF 20V  CAP0603-CAP  [0603-CAP]
U67  AT24CS01-STUM-T  [SOT-23-5]

### Nets
GND: C54.2 U67.P$2(2_GND) U67.P$5(5_WP) ; also sheet 2,3,4,5,6,7,8,9,10,11,12,14,15,16,17
PI_I2C1_SCL: U67.P$1(1_SCL) ; also sheet 2,10,17
PI_I2C1_SDA: U67.P$3(3_SDA) ; also sheet 2,10,17
VCC_3V3: C54.1 U67.P$4(4_VCC) ; also sheet 2,3,4,5,6,9,10,11,12,14,15,17

### Notes on the sheet
- I2C Serial EEPROM
- U67
- AT24CS01-STUM-T
- EEPROM  Address 0x50

## Sheet 14 of 17
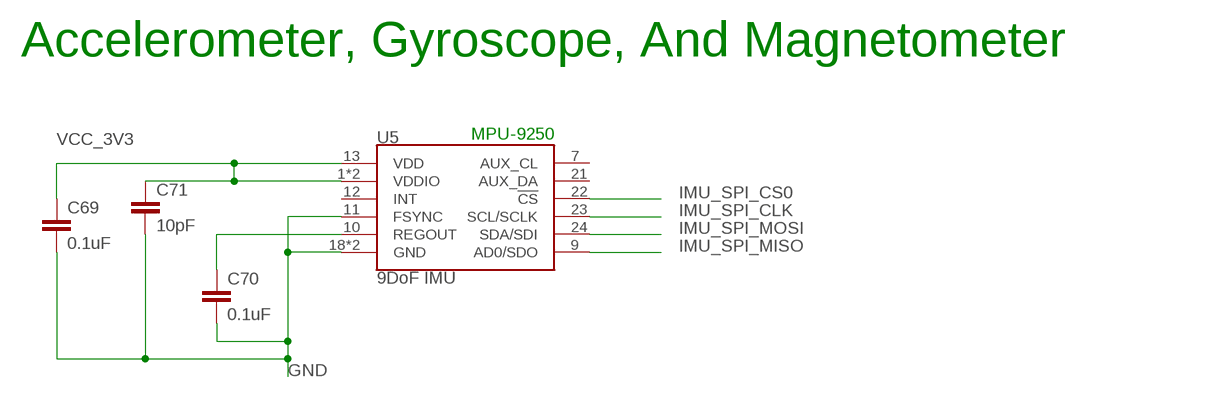
[diagram p13: schematic, sheet 14]

### Parts
C69  0.1uF  0.1UF-0603-25V-5%  [0603]
C70  0.1uF  0.1UF-0603-25V-5%  [0603]
C71  10pF  10PF-0603-50V-5%  [0603]
U5  9DoF IMU  MPU-9250  [QFN24-3X3]

### Nets
GND: C69.2 C70.2 C71.2 U5.11(FSYNC) U5.18(GND) U5.20(GND) ; also sheet 2,3,4,5,6,7,8,9,10,11,12,13,15,16,17
IMU_SPI_CLK: U5.23(SCL/SCLK) ; also sheet 9
IMU_SPI_CS0: U5.22(!CS) ; also sheet 9
IMU_SPI_MISO: U5.9(AD0/SDO) ; also sheet 9
IMU_SPI_MOSI: U5.24(SDA/SDI) ; also sheet 9
N$62: C70.1 U5.10(REGOUT)
VCC_3V3: C69.1 C71.1 U5.1(VDDIO) U5.8(VDDIO) U5.13(VDD) ; also sheet 2,3,4,5,6,9,10,11,12,13,15,17
Unconnected: U5.7(AUX_CL) U5.12(INT) U5.21(AUX_DA)

### Notes on the sheet
- Accelerometer, Gyroscope, And Magnetometer
- MPU-9250

## Sheet 15 of 17
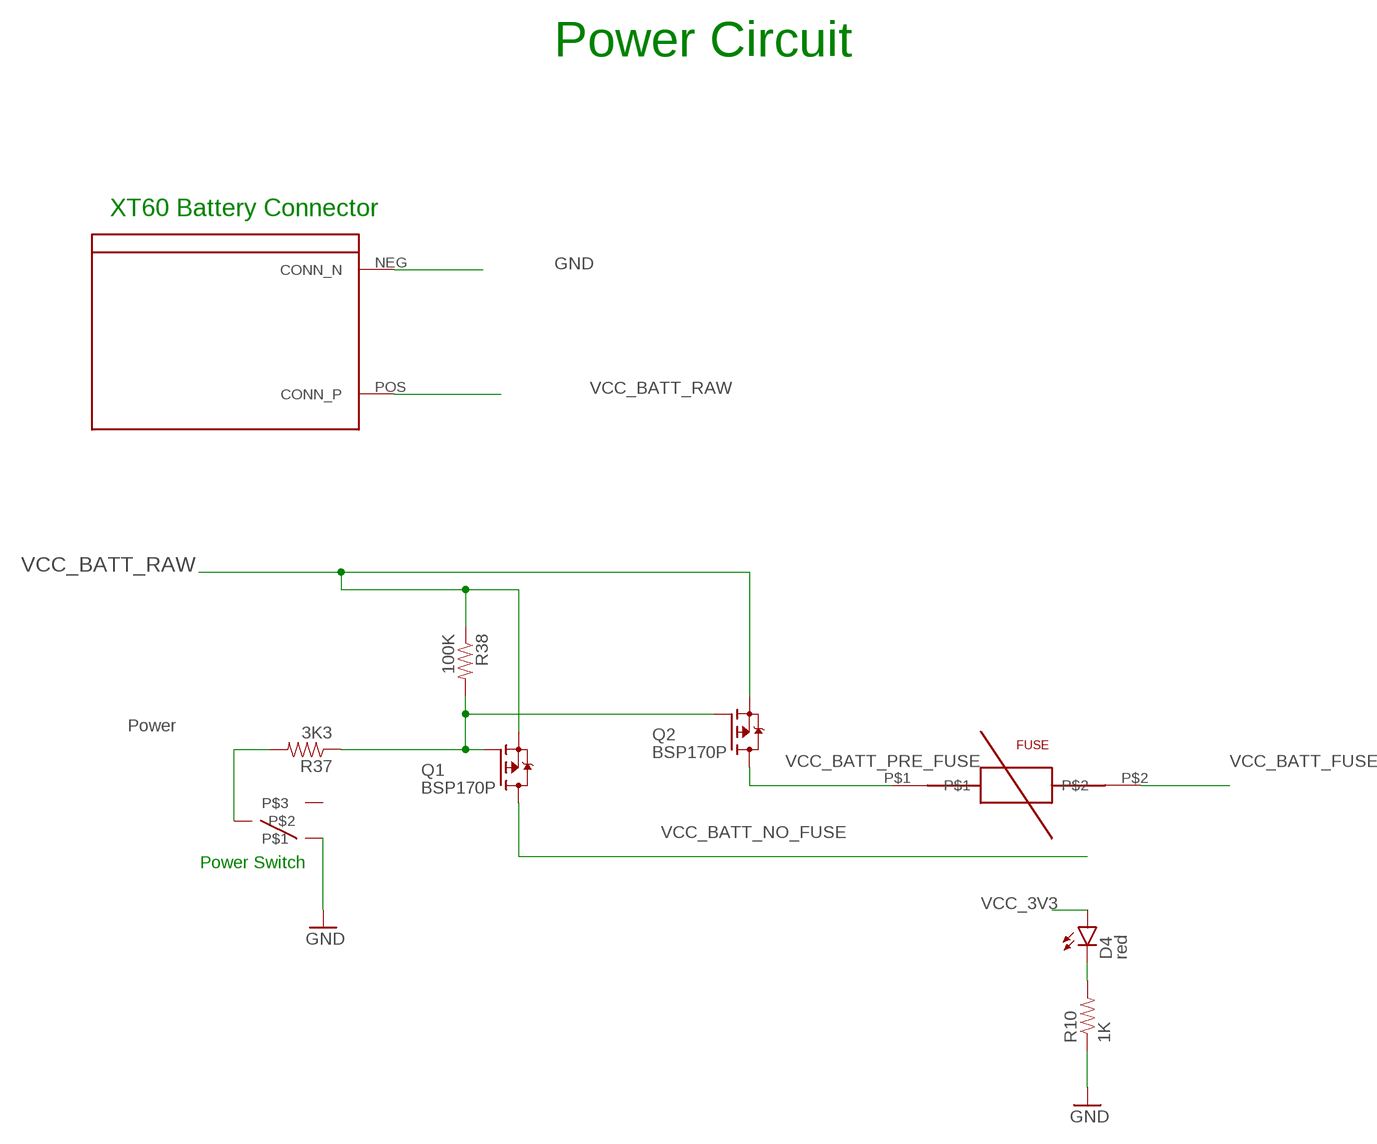
[diagram p14: schematic, sheet 15]

### Parts
D4  red  LED0603  [LED-0603]
Q1  BSP170P  [SOT223]
Q2  BSP170P  [SOT223]
R10  1K  RESISTOR0603-RES  [0603-RES]
R37  3K3  RESISTOR0603-RES  [0603-RES]
R38  100K  RESISTOR0603-RES  [0603-RES]
U3  XT60  [XT60-FP-MH]
U35  SWITCH-OS102011MA1QN1  [OS-SPDT-MINI-SLIDE_SWITCH]
U74  2920L500-16MR  [FUSE-2920]

### Nets
GND: R10.1 U3.NEG(CONN_N) U35.P$1 ; also sheet 2,3,4,5,6,7,8,9,10,11,12,13,14,16,17
N$12: D4.C R10.2
N$25: R37.2 U35.P$2
N$26: Q1.1(G) Q2.1(G) R37.1 R38.2
VCC_3V3: D4.A ; also sheet 2,3,4,5,6,9,10,11,12,13,14,17
VCC_BATT_FUSE: U74.P$2 ; also sheet 12
VCC_BATT_NO_FUSE: Q1.2(D) Q1.4(D) ; also sheet 7,8
VCC_BATT_PRE_FUSE: Q2.2(D) Q2.4(D) U74.P$1
VCC_BATT_RAW: Q1.3(S) Q2.3(S) R38.1 U3.POS(CONN_P) ; also sheet 9
Unconnected: U35.P$3

### Notes on the sheet
- Power Circuit
- XT60 Battery Connector
- Power
- Power Switch

## Sheet 16 of 17
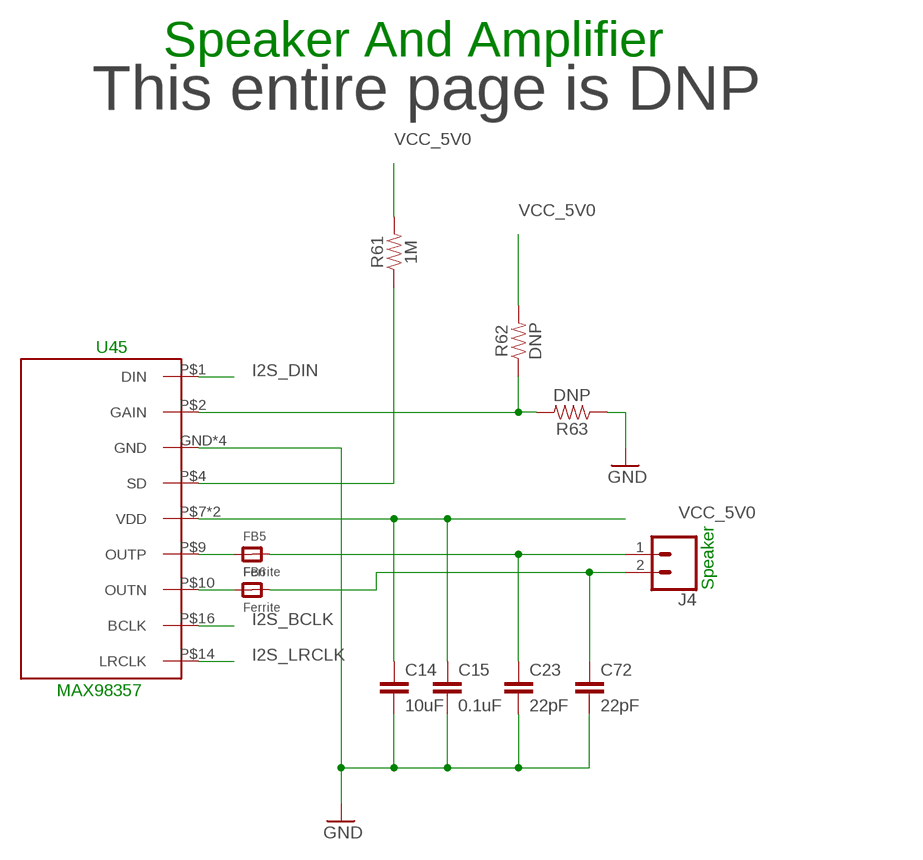
[diagram p15: schematic, sheet 16]

### Parts
C14  10uF  10UF-0603-6.3V-20%  [0603]
C15  0.1uF  0.1UF-0603-25V-5%  [0603]
C23  22pF  22PF-0603-50V-5%  [0603]
C72  22pF  22PF-0603-50V-5%  [0603]
FB5  Ferrite  FERRITE_0805MP  [_0805MP]
FB6  Ferrite  FERRITE_0805MP  [_0805MP]
J4  CONN_02  [1X02]
R61  1M  1MOHM-0603-1/4W-5%  [0603]
R62  DNP  100KOHM-0603-1/10W-1%  [0603]
R63  DNP  100KOHM-0603-1/10W-1%  [0603]
U45  MAX98357  [TQFN-16]

### Nets
GND: C14.2 C15.2 C23.2 C72.2 R63.1 U45.GND U45.P$3(GND) U45.P$11(GND) U45.P$15(GND) ; also sheet 2,3,4,5,6,7,8,9,10,11,12,13,14,15,17
I2S_BCLK: U45.P$16(BCLK) ; also sheet 2
I2S_DIN: U45.P$1(DIN) ; also sheet 2
I2S_LRCLK: U45.P$14(LRCLK) ; also sheet 2
N$11: FB5.1 U45.P$9(OUTP)
N$13: FB6.1 U45.P$10(OUTN)
N$20: C23.1 FB5.2 J4.1
N$66: C72.1 FB6.2 J4.2
N$67: R61.1 U45.P$4(SD)
N$68: R62.1 R63.2 U45.P$2(GAIN)
VCC_5V0: C14.1 C15.1 R61.2 R62.2 U45.P$7(VDD) U45.P$8(VDD) ; also sheet 2,3,8,11,17

### Notes on the sheet
- Speaker And Amplifier
- This entire page is DNP
- U45
- Speaker
- MAX98357

## Sheet 17 of 17
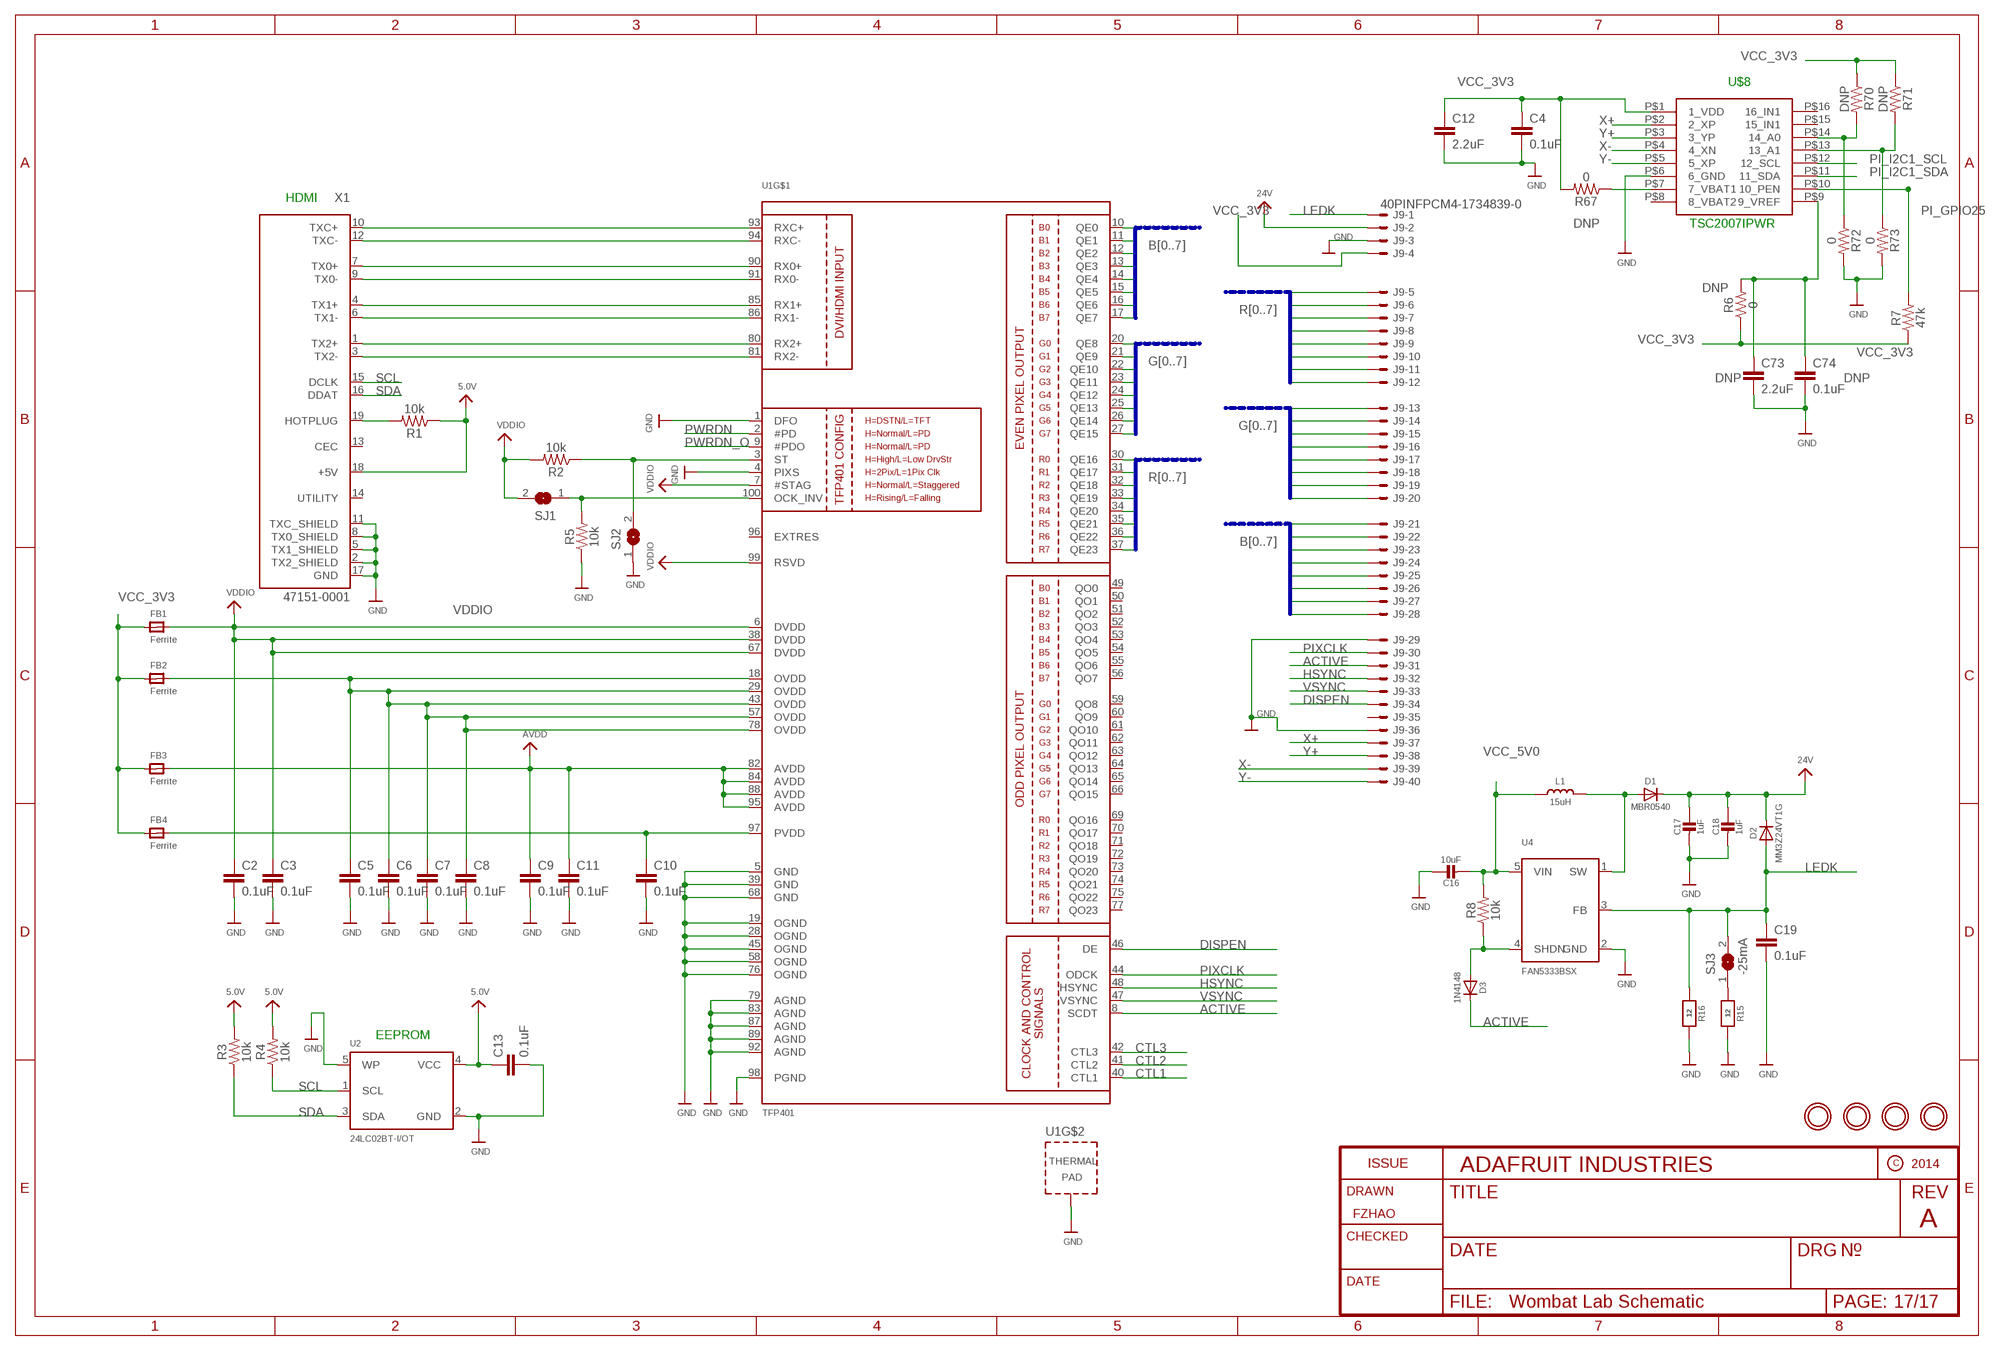
[diagram p16: schematic, sheet 17]

### Parts
C2  0.1uF  0.1UF-0603-25V-(+80/-20%)  [0603]
C3  0.1uF  0.1UF-0603-25V-(+80/-20%)  [0603]
C4  0.1uF  0.1UF-0603-25V-5%  [0603]
C5  0.1uF  0.1UF-0603-25V-(+80/-20%)  [0603]
C6  0.1uF  0.1UF-0603-25V-(+80/-20%)  [0603]
C7  0.1uF  0.1UF-0603-25V-(+80/-20%)  [0603]
C8  0.1uF  0.1UF-0603-25V-(+80/-20%)  [0603]
C9  0.1uF  0.1UF-0603-25V-(+80/-20%)  [0603]
C10  0.1uF  0.1UF-0603-25V-(+80/-20%)  [0603]
C11  0.1uF  0.1UF-0603-25V-(+80/-20%)  [0603]
C12  2.2uF  2.2UF-0603-10V-20%  [0603]
C13  0.1uF  0.1UF-0603-25V-(+80/-20%)  [0603]
C16  10uF  CAP_CERAMIC0805-NOOUTLINE  [0805-NO]
C17  1uF  CAP_CERAMIC0805-NOOUTLINE  [0805-NO]
C18  1uF  CAP_CERAMIC0805-NOOUTLINE  [0805-NO]
C19  0.1uF  0.1UF-0603-25V-5%  [0603]
C73  2.2uF  2.2UF-0603-10V-20%  [0603]
C74  0.1uF  0.1UF-0603-25V-5%  [0603]
D1  MBR0540  DIODESOD-123  [SOD-123]
D2  MM3Z24VT1G  DIODESMA  [SMADIODE]
D3  1N4148  DIODESOD-323  [SOD-323]
FB1  Ferrite  FERRITE_0805MP  [_0805MP]
FB2  Ferrite  FERRITE_0805MP  [_0805MP]
FB3  Ferrite  FERRITE_0805MP  [_0805MP]
FB4  Ferrite  FERRITE_0805MP  [_0805MP]
J9  40PINFPCM4-1734839-0  [4-1734839-0]
L1  15uH  INDUCTORNR5040  [INDUCTOR_5X5MM_NR5040_NOTHERMALS]
R1  10k  10KOHM-0603-1/10W-1%  [0603]
R2  10k  10KOHM-0603-1/10W-1%  [0603]
R3  10k  10KOHM-0603-1/10W-1%  [0603]
R4  10k  10KOHM-0603-1/10W-1%  [0603]
R5  10k  10KOHM-0603-1/10W-1%  [0603]
R6  0  0OHM-0603-1/10W-5%  [0603]
R7  47k  47KOHM-0603-1/10W-1%  [0603]
R8  10k  10KOHM-0603-1/10W-1%  [0603]
R15  12  RESISTOR0805_NOOUTLINE  [0805-NO]
R16  12  RESISTOR0805_NOOUTLINE  [0805-NO]
R67  0  0OHM-0603-1/10W-5%  [0603]
R70  DNP  0OHM-0603-1/10W-5%  [0603]
R71  DNP  0OHM-0603-1/10W-5%  [0603]
R72  0  0OHM-0603-1/10W-5%  [0603]
R73  0  0OHM-0603-1/10W-5%  [0603]
SJ1  SOLDERJUMPER  [SOLDERJUMPER_ARROW_NOPASTE]
SJ2  SOLDERJUMPER  [SOLDERJUMPER_ARROW_NOPASTE]
SJ3  -25mA  SOLDERJUMPERCLOSED  [SOLDERJUMPER_CLOSEDWIRE]
U1  TFP401  [S-PQFP-G100]
U2  24LC02BT-I/OT  EEPROM_I2C_MCP24AA32  [SOT23-5]
U4  FAN5333BSX  VREG_FAN5331  [SOT23-5]
U31  MOUNTINGHOLE3.0  [MOUNTINGHOLE_3.0_PLATED]
U32  MOUNTINGHOLE3.0  [MOUNTINGHOLE_3.0_PLATED]
U33  MOUNTINGHOLE3.0  [MOUNTINGHOLE_3.0_PLATED]
U34  MOUNTINGHOLE3.0  [MOUNTINGHOLE_3.0_PLATED]
U$8  TSC2003  [TSSOP16]
X1  47151-0001  HDMI_MOLEX_47151DIM  [HDMI_MOLEX_47151-0001_DIMLAYER]

### Nets
5.0V: C13.1 R1.1 R3.2 R4.2 U2.4(VCC) X1.18(+5V)
24V: C17.1 C18.1 D1.C D2.C J9.2
ACTIVE: D3.C J9.31 U1.8(SCDT)
AVDD: C9.1 C11.1 FB3.2 U1.82(AVDD) U1.84(AVDD) U1.88(AVDD) U1.95(AVDD)
B0: J9.21 U1.10(QE0)
B1: J9.22 U1.11(QE1)
B2: J9.23 U1.12(QE2)
B3: J9.24 U1.13(QE3)
B4: J9.25 U1.14(QE4)
B5: J9.26 U1.15(QE5)
B6: J9.27 U1.16(QE6)
B7: J9.28 U1.17(QE7)
CTL1: U1.40(CTL1)
CTL2: U1.41(CTL2)
CTL3: U1.42(CTL3)
DISPEN: J9.34 U1.46(DE)
G0: J9.13 U1.20(QE8)
G1: J9.14 U1.21(QE9)
G2: J9.15 U1.22(QE10)
G3: J9.16 U1.23(QE11)
G4: J9.17 U1.24(QE12)
G5: J9.18 U1.25(QE13)
G6: J9.19 U1.26(QE14)
G7: J9.20 U1.27(QE15)
GND: C2.2 C3.2 C4.2 C5.2 C6.2 C7.2 C8.2 C9.2 C10.2 C11.2 C12.2 C13.2 C16.1 C17.2 C18.2 C19.2 C73.2 C74.2 J9.3 J9.29 J9.36 R5.1 R15.2 R16.2 R72.2 R73.2 SJ2.1 U1.1(DFO) U1.4(PIXS) U1.5(GND) U1.19(OGND) U1.28(OGND) U1.39(GND) U1.45(OGND) U1.58(OGND) U1.68(GND) U1.76(OGND) U1.79(AGND) U1.83(AGND) U1.87(AGND) U1.89(AGND) U1.92(AGND) U1.98(PGND) U1.P$1(TP) U1.P$2(TP) U1.P$3(TP) U1.P$4(TP) U1.P$5(TP) U1.P$6(TP) U1.P$7(TP) U1.P$8(TP) U1.P$9(TP) U1.P$10(TP) U1.P$11(TP) U1.P$12(TP) U1.P$13(TP) U1.P$14(TP) U1.P$15(TP) U1.P$16(TP) U1.THERMAL(TP) U2.2(GND) U2.5(WP) U4.2(GND) U$8.P$6(6_GND) X1.2(TX2_SHIELD) X1.5(TX1_SHIELD) X1.8(TX0_SHIELD) X1.11(TXC_SHIELD) X1.17(GND) ; also sheet 2,3,4,5,6,7,8,9,10,11,12,13,14,15,16
HSYNC: J9.32 U1.48(HSYNC)
LEDK: C19.1 D2.A J9.1 R16.1 SJ3.2 U4.3(FB)
N$1: U1.93(RXC+) X1.10(TXC+)
N$2: U1.94(RXC-) X1.12(TXC-)
N$3: U1.90(RX0+) X1.7(TX0+)
N$4: U1.91(RX0-) X1.9(TX0-)
N$5: U1.85(RX1+) X1.4(TX1+)
N$6: U1.86(RX1-) X1.6(TX1-)
N$7: U1.80(RX2+) X1.1(TX2+)
N$8: U1.81(RX2-) X1.3(TX2-)
N$9: R1.2 X1.19(HOTPLUG)
N$14: R67.1 U$8.P$7(7_VBAT1)
N$18: C73.1 C74.1 R6.2 U$8.P$9(9_VREF)
N$44: R71.2 R73.1 U$8.P$13(13_A1)
N$47: D1.A L1.P$2 U4.1(SW)
N$49: R15.1 SJ3.1
N$52: D3.A R8.1 U4.4(SHDN)
N$70: R70.2 R72.1 U$8.P$14(14_A0)
OCK_INV: R5.2 SJ1.1 U1.100(OCK_INV)
OVDD: C5.1 C6.1 C7.1 C8.1 FB2.2 U1.18(OVDD) U1.29(OVDD) U1.43(OVDD) U1.57(OVDD) U1.78(OVDD)
PI_GPIO25: R7.2 U$8.P$10(10_PEN) ; also sheet 2
PI_I2C1_SCL: U$8.P$12(12_SCL) ; also sheet 2,10,13
PI_I2C1_SDA: U$8.P$11(11_SDA) ; also sheet 2,10,13
PIXCLK: J9.30 U1.44(ODCK)
PVDD: C10.1 FB4.2 U1.97(PVDD)
PWRDN: U1.2(#PD)
PWRDN_O: U1.9(#PDO)
R0: J9.5 U1.30(QE16)
R1: J9.6 U1.31(QE17)
R2: J9.7 U1.32(QE18)
R3: J9.8 U1.33(QE19)
R4: J9.9 U1.34(QE20)
R5: J9.10 U1.35(QE21)
R6: J9.11 U1.36(QE22)
R7: J9.12 U1.37(QE23)
SCL: R4.1 U2.1(SCL) X1.15(DCLK)
SDA: R3.1 U2.3(SDA) X1.16(DDAT)
ST: R2.1 SJ2.2 U1.3(ST)
VCC_3V3: C4.1 C12.1 FB1.1 FB2.1 FB3.1 FB4.1 J9.4 R6.1 R7.1 R67.2 R70.1 R71.1 U$8.P$1(1_VDD) ; also sheet 2,3,4,5,6,9,10,11,12,13,14,15
VCC_5V0: C16.2 L1.P$1 R8.2 U4.5(VIN) ; also sheet 2,3,8,11,16
VDDIO: C2.1 C3.1 FB1.2 R2.2 SJ1.2 U1.6(DVDD) U1.7(#STAG) U1.38(DVDD) U1.67(DVDD) U1.99(RSVD)
VSYNC: J9.33 U1.47(VSYNC)
X+: J9.37 U$8.P$2(2_XP)
X-: J9.39 U$8.P$4(4_XN)
Y+: J9.38 U$8.P$3(3_YP)
Y-: J9.40 U$8.P$5(5_XP)
Unconnected: J9.35 U1.49(QO0) U1.50(QO1) U1.51(QO2) U1.52(QO3) U1.53(QO4) U1.54(QO5) U1.55(QO6) U1.56(QO7) U1.59(QO8) U1.60(QO9) U1.61(QO10) U1.62(QO11) U1.63(QO12) U1.64(QO13) U1.65(QO14) U1.66(QO15) U1.69(QO16) U1.70(QO17) U1.71(QO18) U1.72(QO19) U1.73(QO20) U1.74(QO21) U1.75(QO22) U1.77(QO23) U1.96(EXTRES) U$8.P$8(8_VBAT2) U$8.P$15(15_IN1) U$8.P$16(16_IN1) X1.13(CEC) X1.14(UTILITY)

### Buses
B[0..7]
G[0..7]
R[0..7]

### Notes on the sheet
- U$8
- HDMI
- DNP | TSC2007IPWR
- DNP
- DNP | DNP
- EEPROM

## Power pins joined to a net without a drawn wire
GND: X1.P$1(GND) X1.P$2(GND) X1.P$3(GND) X1.P$4(GND)

## Library data of the parts
C1 C20-C22 C24 C26-C68 = SparkFun-Capacitors:CAP: Capacitor Standard 0603 ceramic capacitor, and 0.1" leaded capacitor.
C2 C3 C5-C11 C13 = SparkFun-Capacitors:0.1UF: 0.1µF ceramic capacitors A capacitor is a passive two-terminal electrical component used to store electrical energy temporarily in an electric field.; PROD_ID: CAP-00810
C4 C15 C19 C69 C70 C74 = SparkFun-Capacitors:0.1UF: 0.1µF ceramic capacitors A capacitor is a passive two-terminal electrical component used to store electrical energy temporarily in an electric field.; PROD_ID: CAP-08604
C12 C73 = SparkFun-Capacitors:2.2UF: 2.2µF ceramic capacitors A capacitor is a passive two-terminal electrical component used to store electrical energy temporarily in an electric field.; PROD_ID: CAP-07888
C14 = SparkFun-Capacitors:10UF: 10.0µF ceramic capacitors A capacitor is a passive two-terminal electrical component used to store electrical energy temporarily in an electric field.; PROD_ID: CAP-11015
C16-C18 = microbuilder:CAP_CERAMIC: Ceramic Capacitors For new designs, use the packages preceded by an '_' character since they are more reliable: The following footprints should be used on most boards: _0402 - Standard footprint for regular board layouts _0603 - Standard footprint for regular board layouts _0805 - Standard footprint for regular board layouts _1206 - Standard footprint for regular board layouts For extremely tight-pitch boards where space is at a premium, the following 'micro-pitch' footprints can be used (smaller pads, no silkscreen outline, etc.): _0402MP - Micro-pitch footprint for very dense/compact boards _0603MP - Micro-pitch footprint for very dense/compact boards _0805MP - Micro-pitch footprint for very dense/compact boards _1206MP - Micro-pitch footprint for very dense/compact boards
C23 C72 = SparkFun-Capacitors:22PF: 22pF ceramic capacitors A capacitor is a passive two-terminal electrical component used to store electrical energy temporarily in an electric field.; PROD_ID: CAP-07876
C25 = SparkFun-Capacitors:CAP_POL: Capacitor Polarized These are standard SMD and PTH capacitors. Normally 10uF, 47uF, and 100uF in electrolytic and tantalum varieties. Always verify the external diameter of the through hole cap, it varies with capacity, voltage, and manufacturer. The EIA devices should be standard.
C71 = SparkFun-Capacitors:10PF: 10pF ceramic capacitors A capacitor is a passive two-terminal electrical component used to store electrical energy temporarily in an electric field.; PROD_ID: CAP-11812
D1-D3 = microbuilder:DIODE: Diode SMA Model Volts Amps Type Vf Ir Digikey # Notes SSA34-E3 40V 3A Schottky 480mV @ 3A 200uA @ 40V SSA34-E3/61TGITR-ND CDBA120-G 20V 1A Schottky 500mV @ 1A 500uA @ 20V 641-1014-6-ND REEL MBRA210 10V 2A Schottky 350mV @ 2A 700uA @ 10V MBRA210LT3 SOD-123 Model Volts Amps Type Vf Ir Order # Notes BAT54T1G 30V 200mA Schottky 800mV @ 200mA 2uA @ 25V BAT54T1GOSTR-ND B0530W 30V 500mA Schottky 430mV @ 500mA 130uA @ 30V B0530W-FDICT-ND REEL MBR120 20V 1A Schottky 340mV @ 1A MBR120VLSFT1GOSCT-ND SOD-323 Model Volts Amps Type Vf Ir Order # Notes PMEG2005EJ 20V 500mA Schottky 355mV @ 500mA 568-4110-1-ND ZLLS410 10V 570mA Schottky 380mV @ 570mA ZLLS410CT-ND 1N4148WS 75V 150mA Silicon/Simple 1V 1N4148WSFSCT-ND REEL SOD-523 Model Volts Amps Type Vf Ir Order # Notes BAT54XV2 30V 200mA Schottky 0.8V @ 100mA BAT54XV2CT-ND TB751S 30V 30mA Schottky RB751S-40TE61CT-ND SOT23-R/W (R = Solder Paste/Reflow Ovens, W = Hand-Soldering) Model Volts Amps Type Vf Ir Order # Notes BAT54FILM 40V 300mA Schottky 497-7162-1-ND POWERDI-5 Model Volts Amps Type Vf Ir Order # Notes PDS560 60V 5A Schottky 670mV @ 5A 150uA @ 60V PDS560DICT-ND
D4 D5 = SparkFun-LED:LED: LEDs Standard schematic elements and footprints for 5mm, 3mm, 1206, and 0603 sized LEDs. 5mm - Spark Fun Electronics SKU : COM-00529 (and others)
FB1-FB6 = microbuilder:FERRITE: Ferrite Bead 0603 MMZ1608B121C - 120 Ohm @ 100MHz, 600mA, 0.15 Ohm DC Resistance - Digikey: 445-2164-1-ND BK1608HW121-T - 120 Ohm, 600mA Ferrite Chip - Digikey: 587-1876-2-ND 0805 HZ0805B272R-10 - 2.7K Ohm @ 100MHz, 200mA, 0.8 Ohm DC Resistance - Digikey: 240-2504-1-ND (see also Murata BLM21BD272SN1L) MMZ2012Y152B - 1.5K Ohm @ 100MHz, 500mA, 0.4 Ohm DC Resistance - Digikey: 445-1560-1-ND - Mainly for high frequency (80-400MHz) MMZ2012R102A - 1K Ohm @ 100MHz, 500mA, 0.3 Ohm DC Resistance - Digikey: 445-1555-2-ND - More general purpose (10-200MHz)
J1 = SparkFun-Connectors:CONN_10X2: Multi connection point. Often used as Generic Header-pin footprint for 0.1 inch spaced/style header connections On any of the 0.1 inch spaced packages, you can populate with these: Break Away Headers - Straight <https://www.sparkfun.com/products/116> (PRT-00116) Break Away Male Headers - Right Angle <https://www.sparkfun.com/products/553> (PRT-00553) Female Headers <https://www.sparkfun.com/products/115> (PRT-00115) Break Away Headers - Machine Pin <https://www.sparkfun.com/products/117> (PRT-00117) Break Away Female Headers - Swiss Machine Pin <https://www.sparkfun.com/products/743> (PRT-00743) Special note about the "SPECIAL" package: This was SPECIALLY designed to be used with our Graphic LCD Backpack. Be sure you want to use this! It is not only staggered on each line of header holes, but IT IS ALSO offset of the center point of the top and bottom lines by 5 mil. This causes the headers to lock into place on the "standard" footprint on the LCD screen. The extra squares on the tdocu layer are there simply to reference other pins (if you were to actually populate a longer header than ten long - this is what we do with the backpacks).
J2 = SparkFun-Connectors:CONN_20X2: Multi connection point. Often used as Generic Header-pin footprint for 0.1 inch spaced/style header connections On any of the 0.1 inch spaced packages, you can populate with these: Break Away Headers - Straight <https://www.sparkfun.com/products/116> (PRT-00116) Break Away Male Headers - Right Angle <https://www.sparkfun.com/products/553> (PRT-00553) Female Headers <https://www.sparkfun.com/products/115> (PRT-00115) Break Away Headers - Machine Pin <https://www.sparkfun.com/products/117> (PRT-00117) Break Away Female Headers - Swiss Machine Pin <https://www.sparkfun.com/products/743> (PRT-00743)
J3 = SparkFun-Connectors:CONN_10: Multi connection point. Often used as Generic Header-pin footprint for 0.1 inch spaced/style header connections On any of the 0.1 inch spaced packages, you can populate with these: Break Away Headers - Straight <https://www.sparkfun.com/products/116> (PRT-00116) Break Away Male Headers - Right Angle <https://www.sparkfun.com/products/553> (PRT-00553) Female Headers <https://www.sparkfun.com/products/115> (PRT-00115) Break Away Headers - Machine Pin <https://www.sparkfun.com/products/117> (PRT-00117) Break Away Female Headers - Swiss Machine Pin <https://www.sparkfun.com/products/743> (PRT-00743) Arduino Stackable Header - 10 Pin <https://www.sparkfun.com/products/11376> (PRT-11376) For SCREWTERMINALS and SPRING TERMINALS visit here: Screw Terimnals on SparkFun.com <https://www.sparkfun.com/search/results?term=Screw+Terminals> (5mm/3.5mm/2.54mm spacing) This device is also useful as a general connection point to wire up your design to another part of your project. Our various solder wires solder well into these plated through hole pads. Hook-Up Wire - Assortment (Stranded, 22 AWG) <https://www.sparkfun.com/products/11375> (PRT-11375) Hook-Up Wire - Assortment (Solid Core, 22 AWG) <https://www.sparkfun.com/products/11367> (PRT-11367) View the entire wire category on our website here <https://www.sparkfun.com/categories/141> Special notes: Molex polarized connector foot print use with SKU : PRT-08231 with associated crimp pins and housings. 1MM SMD Version SKU: PRT-10208 NOTES ON THE VARIANTS LOCK and LOCK_LONGPADS... This footprint was designed to help hold the alignment of a through-hole component (i.e. 6-pin header) while soldering it into place. You may notice that each hole has been shifted either up or down by 0.005 of an inch from it's more standard position (which is a perfectly straight line). This slight alteration caused the pins (the squares in the middle) to touch the edges of the holes. Because they are alternating, it causes a "brace" to hold the component in place. 0.005 has proven to be the perfect amount of "off-center" position when using our standard breakaway headers. Although looks a little odd when you look at the bare footprint, once you have a header in there, the alteration is very hard to notice. Also,if you push a header all the way into place, it is covered up entirely on the bottom side.; PROD_ID: CONN-11563
J4 = SparkFun-Connectors:CONN_02: Multi connection point. Often used as Generic Header-pin footprint for 0.1 inch spaced/style header connections On any of the 0.1 inch spaced packages, you can populate with these: Break Away Headers - Straight <https://www.sparkfun.com/products/116> (PRT-00116) Break Away Male Headers - Right Angle <https://www.sparkfun.com/products/553> (PRT-00553) Female Headers <https://www.sparkfun.com/products/115> (PRT-00115) Break Away Headers - Machine Pin <https://www.sparkfun.com/products/117> (PRT-00117) Break Away Female Headers - Swiss Machine Pin <https://www.sparkfun.com/products/743> (PRT-00743) For SCREWTERMINALS and SPRING TERMINALS visit here: Screw Terimnals on SparkFun.com <https://www.sparkfun.com/search/results?term=Screw+Terminals> (5mm/3.5mm/2.54mm spacing) This device is also useful as a general connection point to wire up your design to another part of your project. Our various solder wires solder well into these plated through hole pads. Hook-Up Wire - Assortment (Stranded, 22 AWG) <https://www.sparkfun.com/products/11375> (PRT-11375) Hook-Up Wire - Assortment (Solid Core, 22 AWG) <https://www.sparkfun.com/products/11367> (PRT-11367) View the entire wire category on our website here <https://www.sparkfun.com/categories/141> Special notes: Molex polarized connector foot print use with: PRT-08233 with associated crimp pins and housings. 2.54_SCREWTERM for use with PRT-10571. 3.5mm Screw Terminal footprints for PRT-08084 5mm Screw Terminal footprints for use with PRT-08432
J7 = SparkFun-Connectors:M06: Header 6 Standard 6-pin 0.1" header. Use with straight break away headers (SKU : PRT-00116), right angle break away headers (PRT-00553), swiss pins (PRT-00743), machine pins (PRT-00117), and female headers (PRT-00115). Molex polarized connector foot print use with SKU : PRT-08094 with associated crimp pins and housings. NOTES ON THE VARIANTS LOCK and LOCK_LONGPADS... This footprint was designed to help hold the alignment of a through-hole component (i.e. 6-pin header) while soldering it into place. You may notice that each hole has been shifted either up or down by 0.005 of an inch from it's more standard position (which is a perfectly straight line). This slight alteration caused the pins (the squares in the middle) to touch the edges of the holes. Because they are alternating, it causes a "brace" to hold the component in place. 0.005 has proven to be the perfect amount of "off-center" position when using our standard breakaway headers. Although looks a little odd when you look at the bare footprint, once you have a header in there, the alteration is very hard to notice. Also,if you push a header all the way into place, it is covered up entirely on the bottom side. This idea of altering the position of holes to aid alignment will be further integrated into the Sparkfun Library for other footprints. It can help hold any component with 3 or more connection pins.; PROD_ID: CONN-08437
J8 J10 = SparkFun-Connectors:M03X2: 2x3 .1" header. Shrouded, with keying- CONN-10681 SMT- CONN-11415 Pogo pins- HW-11044; PROD_ID: CONN-11566
J9 = adafruit:40PINFPC: OMRON FPC Connector Source : http://www.omron.com/ecb/products/pdf/fpc.pdf XF2M-4015-rev is good for connecting up 'PSP' SHARP LQ043 LCDs
J15 = SparkFun-Connectors:M06X2; PROD_ID: CONN-12423
L1 = microbuilder:INDUCTOR: Inductors 0603: 10nH Ceramic Inductor - microwire antenna/RF (Digikey: 712-1434-2-ND) 0805: 560nH Ceramic Inductor - RF (Digikey: 553-1047-1-ND) 270nH Ceramic Inductor - Q = 40@250MHz, +-5%, 1 Ohm DC Resistance (Digikey: 535-10506-2-ND) 1007 (2518 Metric) SMT: 10µH 10% 250mOhm 820mA 1007 Inductor (Digikey: 587-2189-1-ND) 22µH 10% 500mOhm 580mA 1007 Inductor (Digikey: 587-2190-1-ND) 47µH 10% 950mOhm 420mA 1007 Inductor (Digikey: 587-2191-1-ND) 47µH 5% 100mOhm 1A 1008 Inductor (Digikey: 732-1816-1-ND) 5.0x5.0mm (Taiyo Yuden NR5040 Series) 6.8µH 20% 2.3A 64mOhm Inductor (Digikey: 587-2374-2-ND) 5.0x5.0mm (TDK VLC5045 Series) 4.7µH 20% 3.3A 34mOhm Inductor (Digikey: 445-6526-1-ND) 6.8µH 20% 2.7A 46mOhm Inductor (Digikey: 445-6527-1-ND) 6.0x6.0mm (TDK VLC6045 Series) 4.7µH 20% 3.8A 27mOhm Inductor (Digikey: 445-6538-2-ND) 6.8µH 20% 3A 41mOhm Inductor (Digikey: 445-6540-1-ND) 6.2µH 30% 2.2A 45mOhm Inductor (Digikey: SRR5028-6R2YCT-ND) - Not TDK VLC6045 but footprint should match 6.0x6.0mm (TDK SLF6045 Series) 6.8uH 30% 2A 33mOhm Inductor (Digikey: 445-4572-1-ND, Mouser: 810-SLF645T6R8N2R0PF) 6.0x6.0mm (Sumida CDRH5D28 Series) 6.2uH 30% 1.8A 45mOhm Inductor (Digikey: 308-1542-1-ND) Taiyo Yuden NR3015T2R2M - 2.2uH 20% 1.5A (Digikey: 587-1648-2-ND, Mouser: 963-NR3015T2R2M) - Used with TI TPS62172 CoilCraft RFID Transponder Coil - MA5532-AE (For use with AS3935 Lightning Sensor) Vishay IHLP 1.0uH Molded Inductor - 24mOhm DCR, 5A, +/-20%, -55°C-125°C (Digikey: 541-1319-1-ND)
L2 L4 = kipr:INDUCTOR-COMBO-3232-1050
Q1 Q2 = transistor-fet:BSP170P: SIPMOS(R) Small-Signal-Transistor P-Channel, Enhancement mode Source: http://www.infineon.com/upload/Document/BSP170P_Rev2.4.pdf
R1-R5 R8 R65 = SparkFun-Resistors:10KOHM: 10kΩ resistor A resistor is a passive two-terminal electrical component that implements electrical resistance as a circuit element. Resistors act to reduce current flow, and, at the same time, act to lower voltage levels within circuits. - Wikipedia; PROD_ID: RES-00824
R6 R66 R67 R72 R73 = SparkFun-Resistors:0OHM: 0Ω resistor A resistor is a passive two-terminal electrical component that implements electrical resistance as a circuit element. Resistors act to reduce current flow, and, at the same time, act to lower voltage levels within circuits. - Wikipedia; PROD_ID: RES-08609
R7 = SparkFun-Resistors:47KOHM: 47kΩ resistor A resistor is a passive two-terminal electrical component that implements electrical resistance as a circuit element. Resistors act to reduce current flow, and, at the same time, act to lower voltage levels within circuits. - Wikipedia; PROD_ID: RES-07871
R9 R10 R12 R13 R28 R30 R31 R37 R38 R57-R60 = SparkFun-Passives:RESISTOR: Resistor Basic schematic elements and footprints for 0603, 1206, and PTH resistors.
R11 R14 R17-R27 R29 R32-R36 R39-R56 = SparkFun-Resistors:RESISTOR: Resistor Basic schematic elements and footprints for 0603, 1206, and PTH resistors.
R15 R16 = microbuilder:RESISTOR: Resistors For new designs, use the packages preceded by an '_' character since they are more reliable: The following footprints should be used on most boards: _0402 - Standard footprint for regular board layouts _0603 - Standard footprint for regular board layouts _0805 - Standard footprint for regular board layouts _1206 - Standard footprint for regular board layouts For extremely tight-pitch boards where space is at a premium, the following 'micro-pitch' footprints can be used (smaller pads, no silkscreen outline, etc.): _0402MP - Micro-pitch footprint for very dense/compact boards _0603MP - Micro-pitch footprint for very dense/compact boards _0805MP - Micro-pitch footprint for very dense/compact boards _1206MP - Micro-pitch footprint for very dense/compact boards
R61 = SparkFun-Resistors:1MOHM: 1MΩ resistor A resistor is a passive two-terminal electrical component that implements electrical resistance as a circuit element. Resistors act to reduce current flow, and, at the same time, act to lower voltage levels within circuits. - Wikipedia; PROD_ID: RES-07868
R62 R63 = SparkFun-Resistors:100KOHM: 100kΩ resistor A resistor is a passive two-terminal electrical component that implements electrical resistance as a circuit element. Resistors act to reduce current flow, and, at the same time, act to lower voltage levels within circuits. - Wikipedia; PROD_ID: RES-07828; VALUE: 100k
R64 = SparkFun-Resistors:100KOHM: 100kΩ resistor A resistor is a passive two-terminal electrical component that implements electrical resistance as a circuit element. Resistors act to reduce current flow, and, at the same time, act to lower voltage levels within circuits. - Wikipedia; PROD_ID: RES-07828
R68 R69 = SparkFun-Resistors:1.20KOHM: 1.20kΩ resistor A resistor is a passive two-terminal electrical component that implements electrical resistance as a circuit element. Resistors act to reduce current flow, and, at the same time, act to lower voltage levels within circuits. - Wikipedia; PROD_ID: RES-08413
R70 R71 = SparkFun-Resistors:0OHM: 0Ω resistor A resistor is a passive two-terminal electrical component that implements electrical resistance as a circuit element. Resistors act to reduce current flow, and, at the same time, act to lower voltage levels within circuits. - Wikipedia; PROD_ID: RES-08609; VALUE: 0
SJ1 SJ2 = microbuilder:SOLDERJUMPER: SMD Solder JUMPER Solder the two pads together to create a connection, or remove the solder to break it. REFLOW - Use this footprint for solder paste and reflow ovens. WAVE - Use this footprint for hand-soldering (larger pads). CLOSED - Has a trace between the two pads to ensure it is closed by default. The trace needs to be cut to disable the jumper, and can be closed again by creating a solder bridge between the two pads.; BOM: EXCLUDE
SJ3 = microbuilder:SOLDERJUMPER: SMD Solder JUMPER Solder the two pads together to create a connection, or remove the solder to break it. REFLOW - Use this footprint for solder paste and reflow ovens. WAVE - Use this footprint for hand-soldering (larger pads). CLOSED - Has a trace between the two pads to ensure it is closed by default. The trace needs to be cut to disable the jumper, and can be closed again by creating a solder bridge between the two pads.
U1 = microbuilder:TFP401: TFP401 PanelBus Digital Receiver Supports Pixel Rates Up to 165 MHz (Including 1080p and WUXGA at 60Hz) Supply Voltage: 3.0-3.6V Operating Temperature: 0-70°C (EP version exists with -55-125°C)
U2 = microbuilder:EEPROM_I2C_MCP24AA32: Microchip 32K (4K x 8) 1.8V I2C EEPROM SOT23-5 [Digikey: 24AA32AFT-I/OTCT-ND]
U3 = dongle:XT60
U4 = microbuilder:VREG_FAN5331: FAN5331 - LED/OLED 20V Boost Converter Digikey: FAN5331SXCT-ND
U5 = SparkFun-Sensors:MPU-9250: MPU-9250 9 Degree of Freedom IMU System in Package that contains MPU-6500 & AK8963 NC pin 19. 2-6 & 14-17 not internally connected. May be used for PCB trace routing. Datasheet <https://cdn.sparkfun.com/assets/learn_tutorials/5/5/0/MPU9250REV1.0.pdf> SparkFun Products: SparkFun 9DoF Razor IMU M0 <https://www.sparkfun.com/products/14001> SparkFun IMU Breakout - MPU-9250 <https://www.sparkfun.com/products/13762>; PROD_ID: IC-13192
U7 = kipr:LM3671
U8 = kipr:CDRH2D14NP
U30 U41 U76 U77 = kipr:CONN-HEADER-5-103414-1
U31-U34 = microbuilder:MOUNTINGHOLE: Mounting Hole For #2 screws (0.086"/2.18mm width, 0.094"/2.4mm hole) use 2.5mm; BOM: EXCLUDE
U35 = kipr:SWITCH-OS102011MA1QN1
U37 = kipr:STM32F427VIT6
U38 = kipr:TSX-3325
U39 = kipr:CORTEX_JTAG
U42 = kipr:COINCELL_6P8MM: Panasonic: ML-621S/ZTN
U43 = kipr:DS1340U
U44 = kipr:CRYSTAL-ECS-ECX34B: ECS-.327-12.5-34B-TR 32.768 kHz 20PPM
U45 = kipr:MAX98357
U56 = kipr:TXS0104
U61 U64 = kipr:TB6612FNG
U62 U63 U65 U66 = kipr:APB3025ESGC-F01
U67 = kipr:AT24CS01-STUM-T
U68-U71 = kipr:FUSE-RESET-0603L100SLYR
U72 U73 = kipr:AP65502SP-13: 4A Buck Switching Regulator
U74 = kipr:2920L500-16MR
U75 = kipr:PUSHBUTTON-1571527-2
U$8 = kipr:TSC2003
X1 = microbuilder:HDMI_MOLEX_47151: The default footprint uses layer 46 (Milling) for the tabs, the DIMLAYER footprint uses layer 20 (Dimensions). Both will probably require special instructions to the board house